# EAGLE design SSPS Front Panel Test (EAGLE 7.4.0)
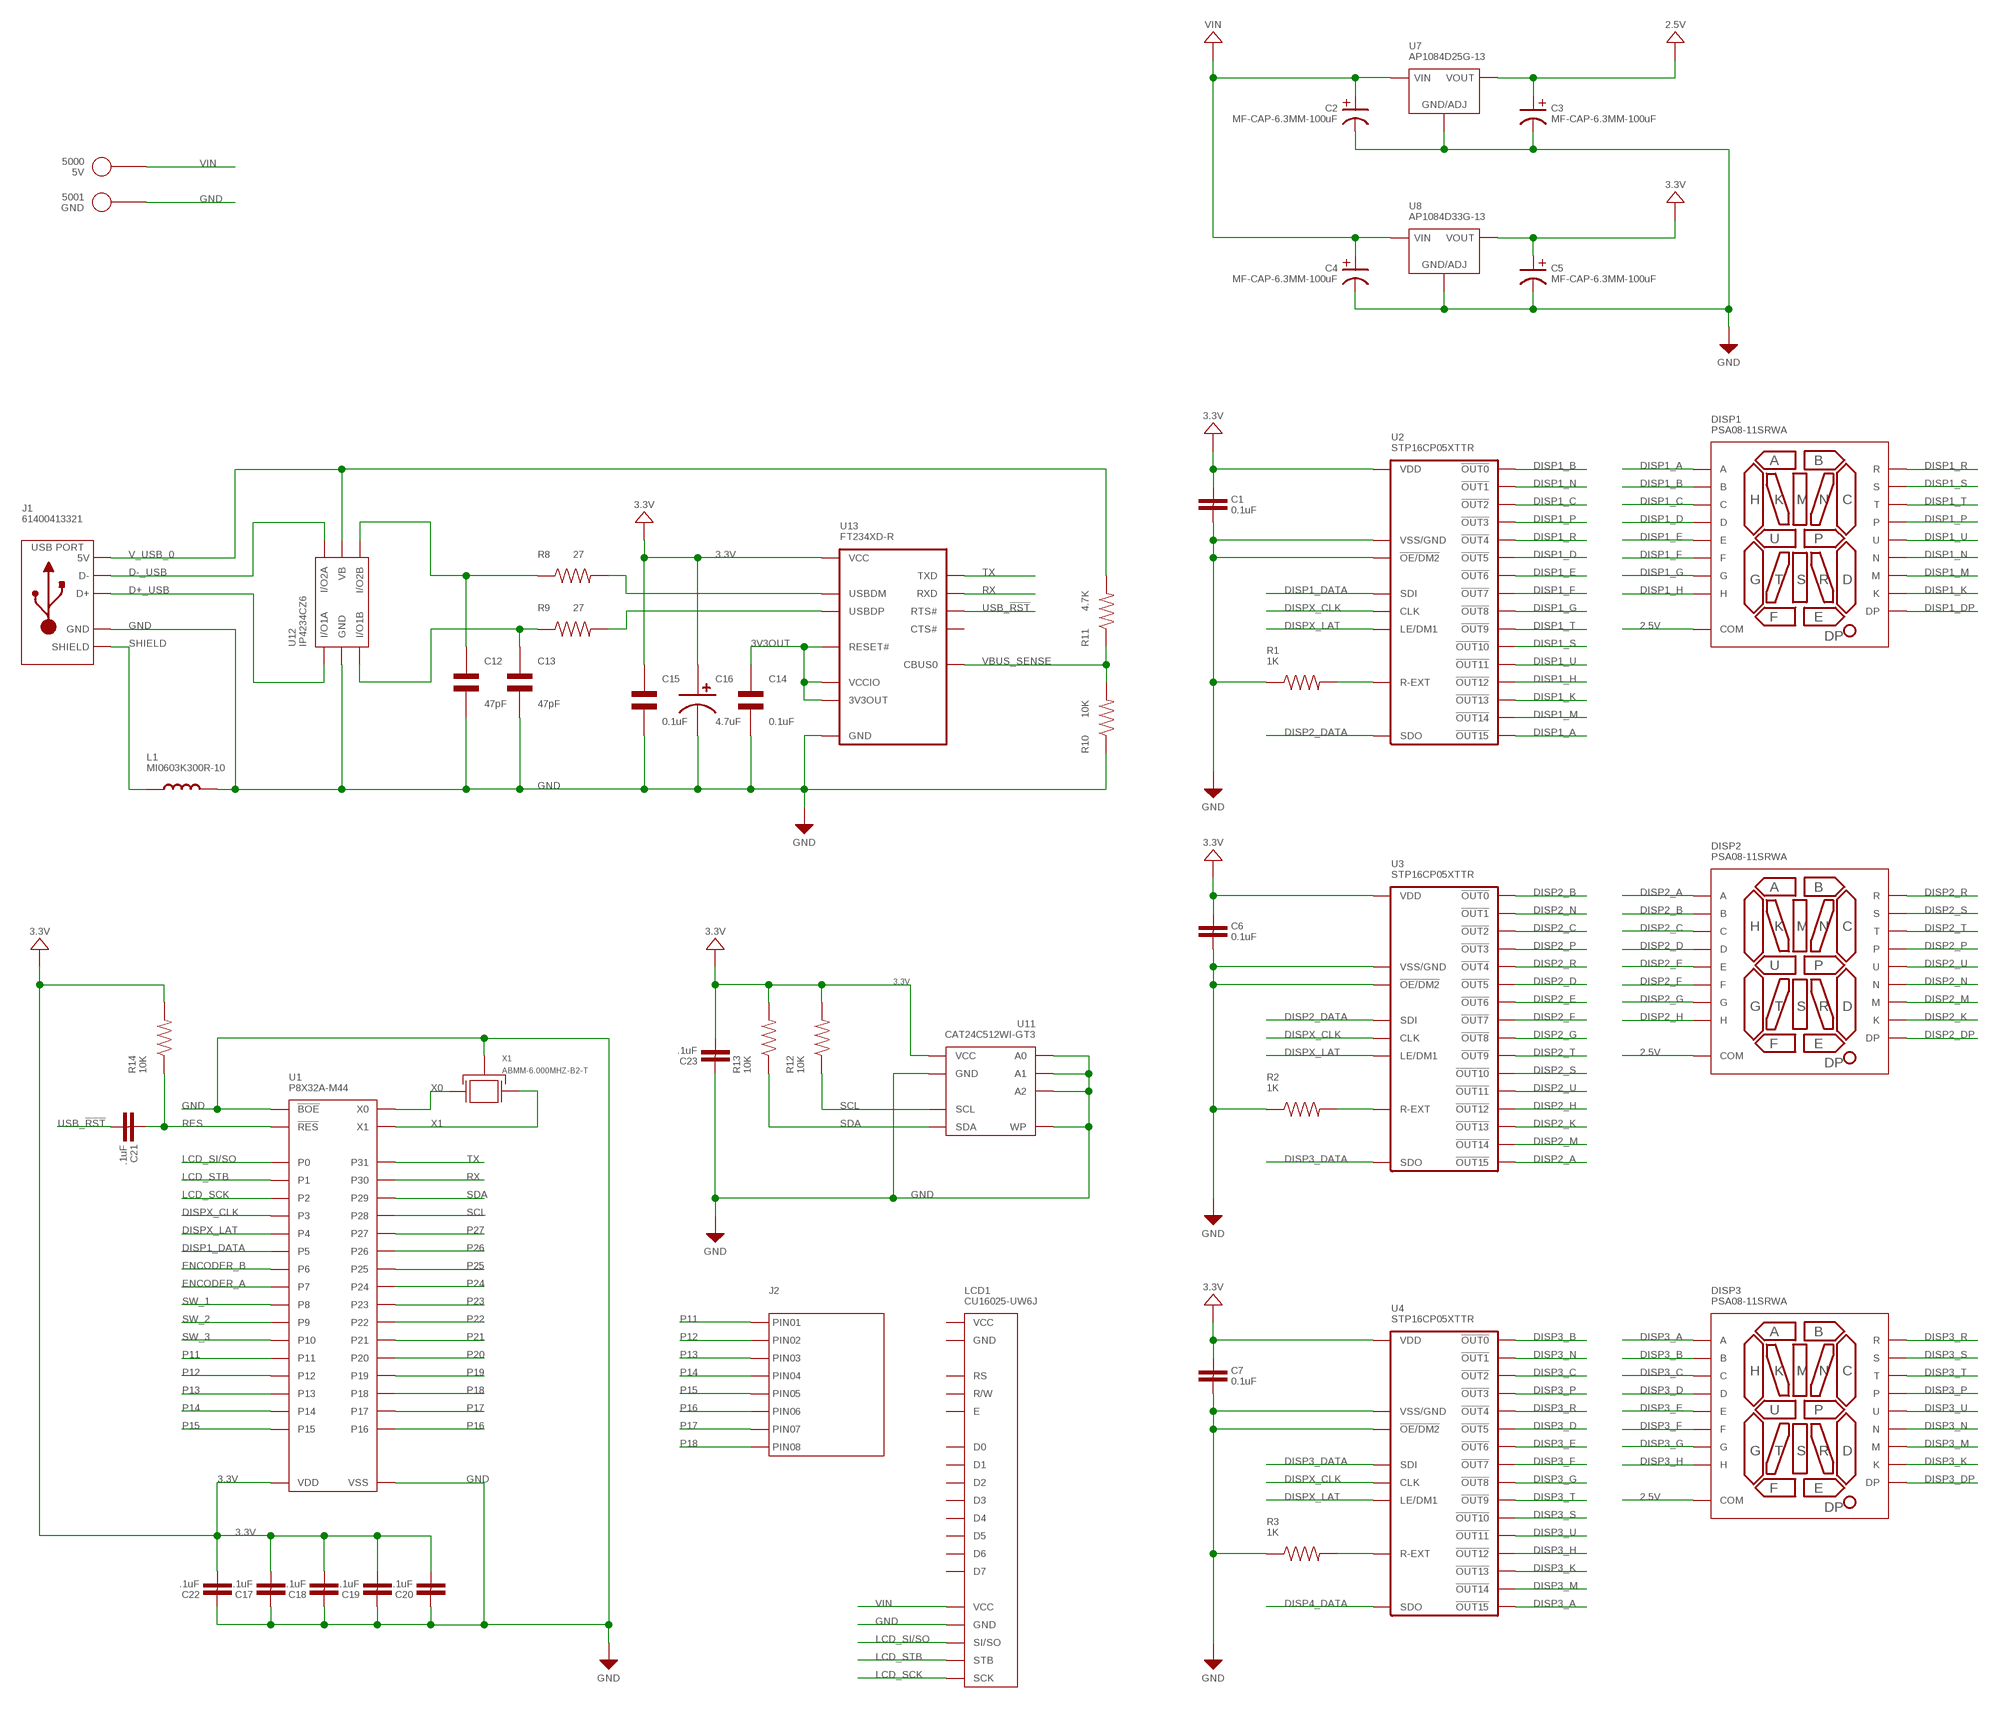
[diagram p0: schematic, sheet 1, part 1 of 3]
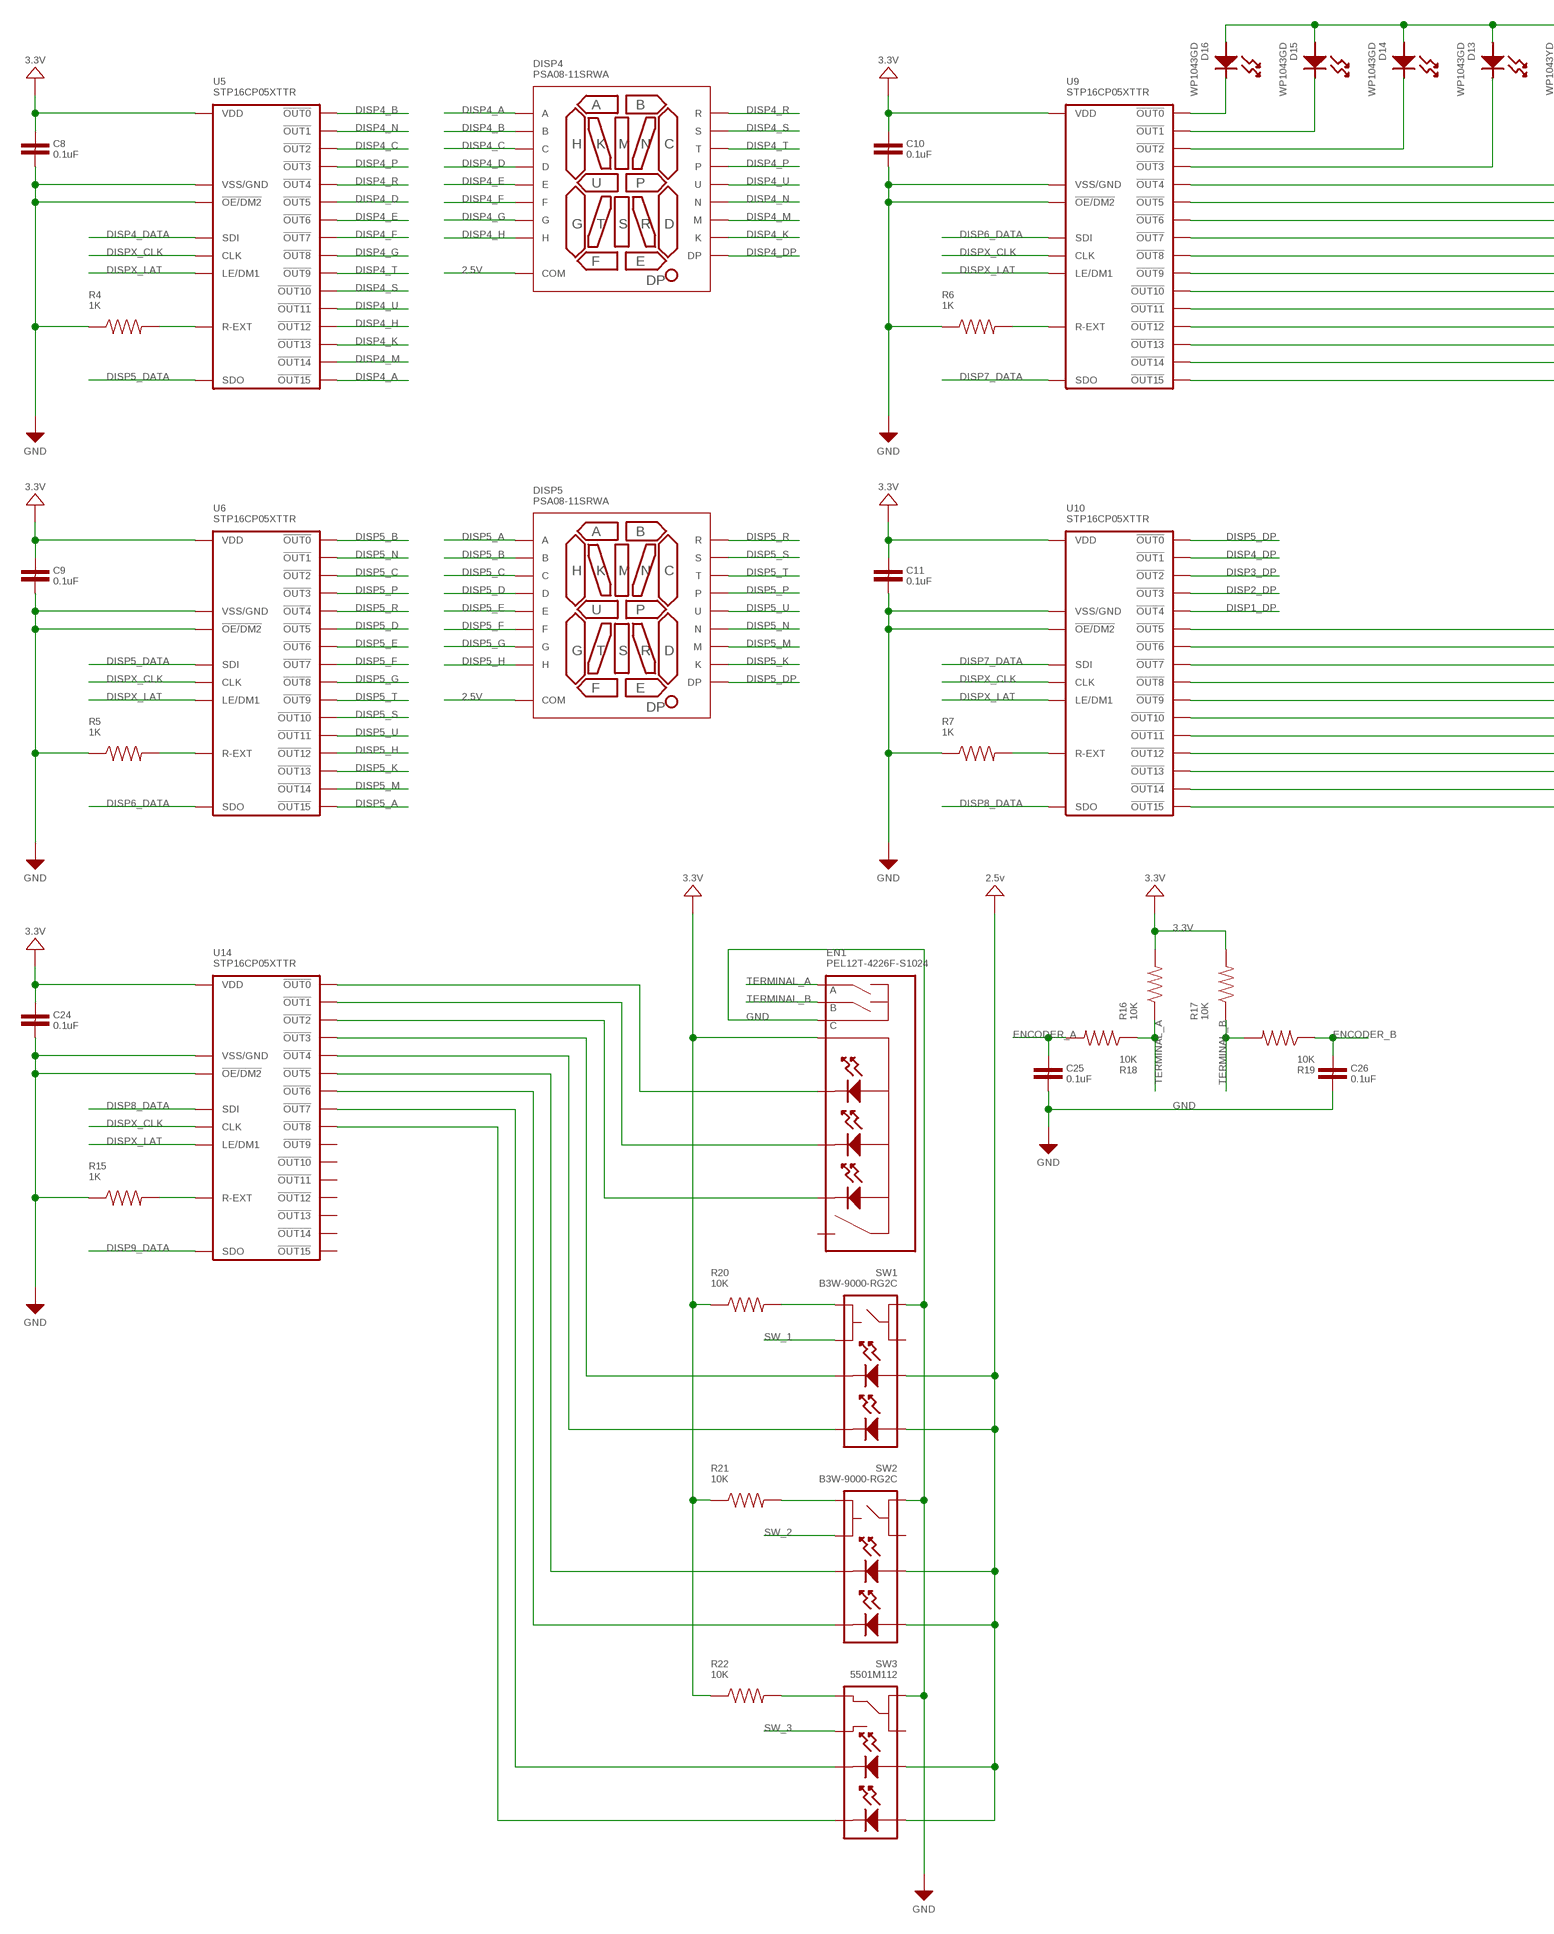
[diagram p1: schematic, sheet 1, part 2 of 3]
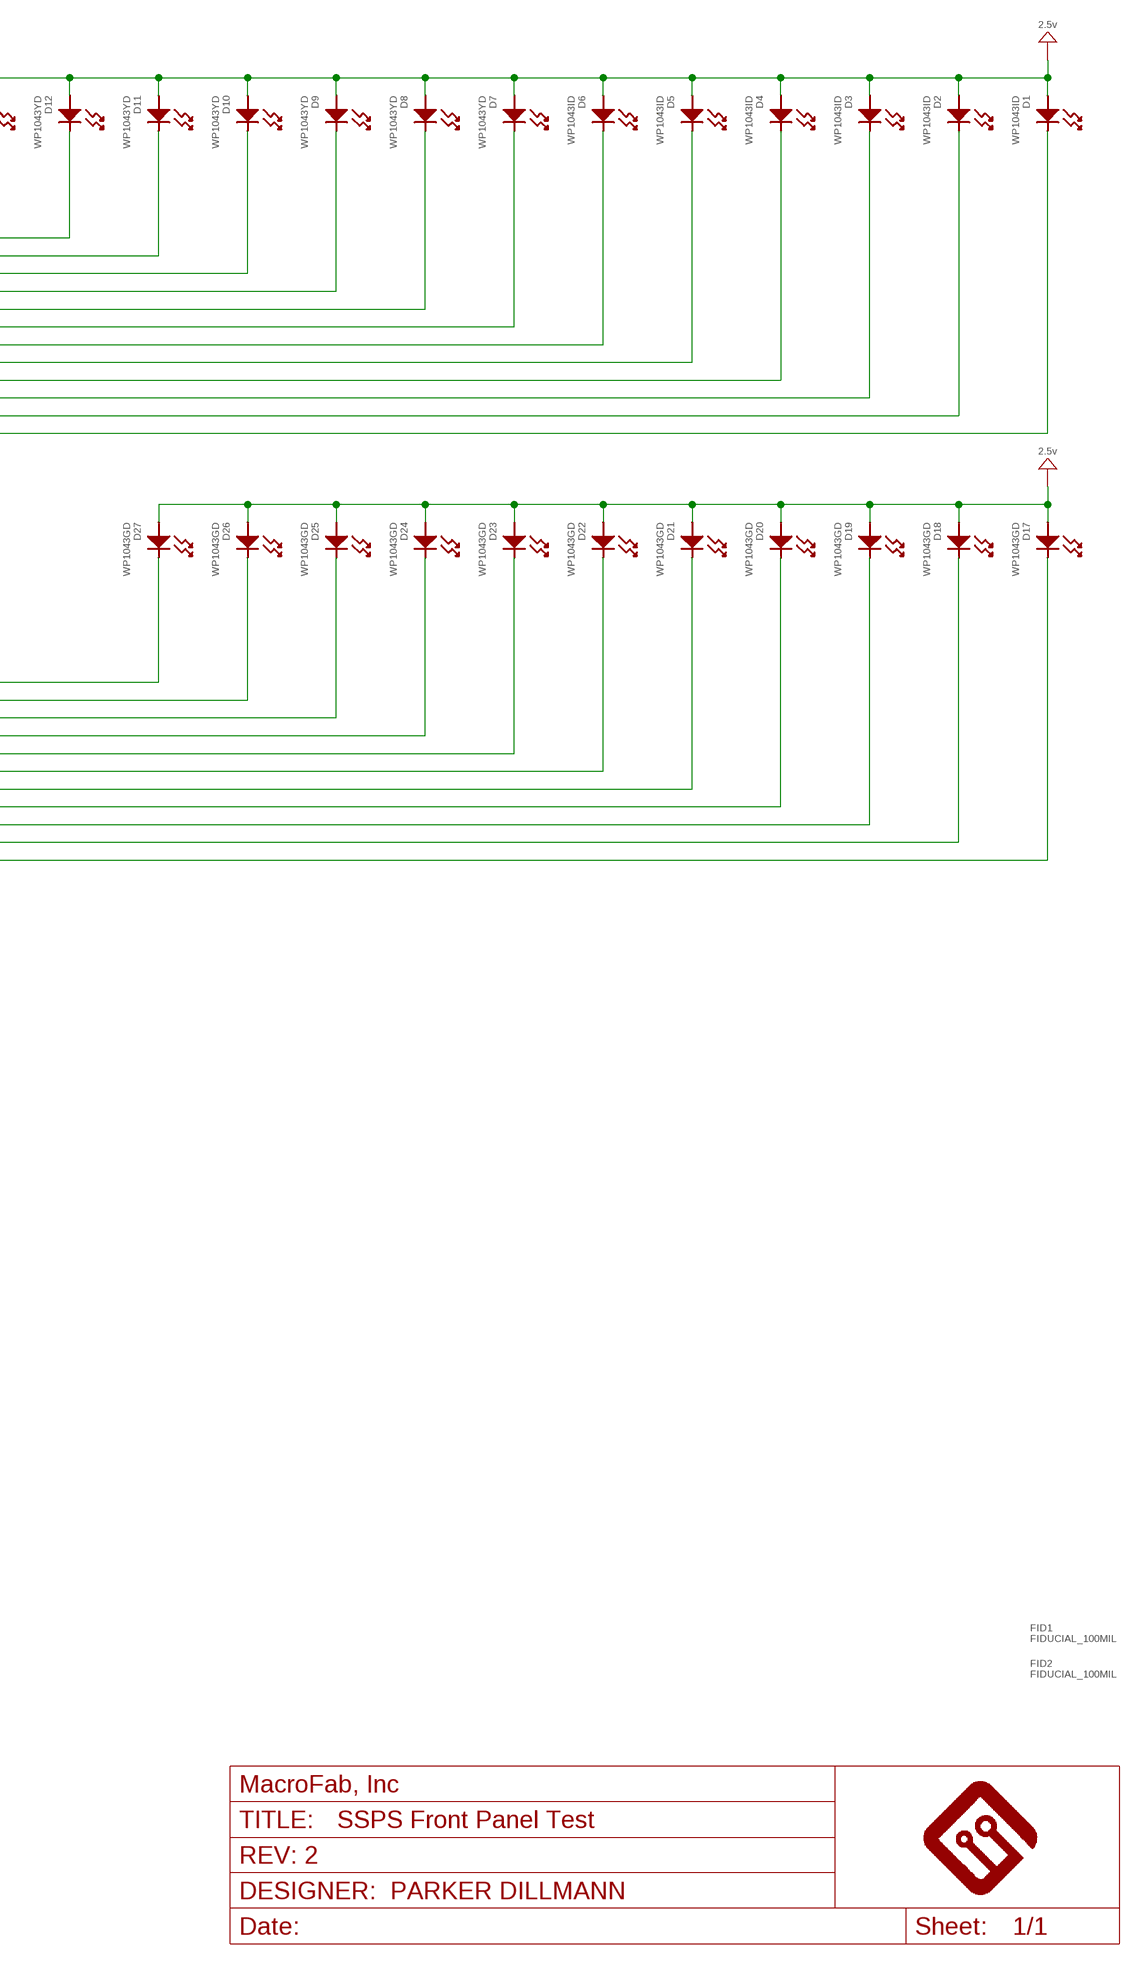
[diagram p2: schematic, sheet 1, part 3 of 3]

## Parts
5V  5000  TEST_POINT_SINGLE_KEYSTONE_5115-5119  [KEYSTONE_5115-5119]
C1  0.1uF  CAPACITOR_NON_POLAR_0603  [0603]
C2  MF-CAP-6.3MM-100uF  CAPACITOR_POLARIZED_6.3MM_SMD  [6.3MM_CAP_SMD]
C3  MF-CAP-6.3MM-100uF  CAPACITOR_POLARIZED_6.3MM_SMD  [6.3MM_CAP_SMD]
C4  MF-CAP-6.3MM-100uF  CAPACITOR_POLARIZED_6.3MM_SMD  [6.3MM_CAP_SMD]
C5  MF-CAP-6.3MM-100uF  CAPACITOR_POLARIZED_6.3MM_SMD  [6.3MM_CAP_SMD]
C6  0.1uF  CAPACITOR_NON_POLAR_0603  [0603]
C7  0.1uF  CAPACITOR_NON_POLAR_0603  [0603]
C8  0.1uF  CAPACITOR_NON_POLAR_0603  [0603]
C9  0.1uF  CAPACITOR_NON_POLAR_0603  [0603]
C10  0.1uF  CAPACITOR_NON_POLAR_0603  [0603]
C11  0.1uF  CAPACITOR_NON_POLAR_0603  [0603]
C12  47pF  CAPACITOR_NP_0603  [C0603]
C13  47pF  CAPACITOR_NP_0603  [C0603]
C14  0.1uF  CAPACITOR_NP_0603  [C0603]
C15  0.1uF  CAPACITOR_NP_0603  [C0603]
C16  4.7uF  CAPACITOR_P_4MM  [CP4MM]
C17  .1uF  CAPACITOR_NON_POLAR_0603  [0603]
C18  .1uF  CAPACITOR_NON_POLAR_0603  [0603]
C19  .1uF  CAPACITOR_NON_POLAR_0603  [0603]
C20  .1uF  CAPACITOR_NON_POLAR_0603  [0603]
C21  .1uF  CAPACITOR_NON_POLAR_0603  [0603]
C22  .1uF  CAPACITOR_NON_POLAR_0603  [0603]
C23  .1uF  CAPACITOR_NON_POLAR_0603  [0603]
C24  0.1uF  CAPACITOR_NON_POLAR_0603  [0603]
C25  0.1uF  CAPACITOR_NON_POLAR_0603  [0603]
C26  0.1uF  CAPACITOR_NON_POLAR_0603  [0603]
D1  WP1043ID  LED_SINGLE_WP1043  [WP1043]
D2  WP1043ID  LED_SINGLE_WP1043  [WP1043]
D3  WP1043ID  LED_SINGLE_WP1043  [WP1043]
D4  WP1043ID  LED_SINGLE_WP1043  [WP1043]
D5  WP1043ID  LED_SINGLE_WP1043  [WP1043]
D6  WP1043ID  LED_SINGLE_WP1043  [WP1043]
D7  WP1043YD  LED_SINGLE_WP1043  [WP1043]
D8  WP1043YD  LED_SINGLE_WP1043  [WP1043]
D9  WP1043YD  LED_SINGLE_WP1043  [WP1043]
D10  WP1043YD  LED_SINGLE_WP1043  [WP1043]
D11  WP1043YD  LED_SINGLE_WP1043  [WP1043]
D12  WP1043YD  LED_SINGLE_WP1043  [WP1043]
D13  WP1043GD  LED_SINGLE_WP1043  [WP1043]
D14  WP1043GD  LED_SINGLE_WP1043  [WP1043]
D15  WP1043GD  LED_SINGLE_WP1043  [WP1043]
D16  WP1043GD  LED_SINGLE_WP1043  [WP1043]
D17  WP1043GD  LED_SINGLE_WP1043  [WP1043]
D18  WP1043GD  LED_SINGLE_WP1043  [WP1043]
D19  WP1043GD  LED_SINGLE_WP1043  [WP1043]
D20  WP1043GD  LED_SINGLE_WP1043  [WP1043]
D21  WP1043GD  LED_SINGLE_WP1043  [WP1043]
D22  WP1043GD  LED_SINGLE_WP1043  [WP1043]
D23  WP1043GD  LED_SINGLE_WP1043  [WP1043]
D24  WP1043GD  LED_SINGLE_WP1043  [WP1043]
D25  WP1043GD  LED_SINGLE_WP1043  [WP1043]
D26  WP1043GD  LED_SINGLE_WP1043  [WP1043]
D27  WP1043GD  LED_SINGLE_WP1043  [WP1043]
DISP1  PSA08-11SRWA  [PSA08-11SRWA]
DISP2  PSA08-11SRWA  [PSA08-11SRWA]
DISP3  PSA08-11SRWA  [PSA08-11SRWA]
DISP4  PSA08-11SRWA  [PSA08-11SRWA]
DISP5  PSA08-11SRWA  [PSA08-11SRWA]
EN1  PEL12T-4226F-S1024  PEL12T  [PEL12T]
FID1  FIDUCIAL_100MIL  [FIDUCIAL_100MIL]
FID2  FIDUCIAL_100MIL  [FIDUCIAL_100MIL]
FRAME1  MF_FRAMEDEFAULT  [MF_FRAME_DEFAULT]
GND  5001  TEST_POINT_SINGLE_KEYSTONE_5115-5119  [KEYSTONE_5115-5119]
J1  61400413321  USB_4PIN_61400413321  [61400413321]
J2  CON_01X08_2.54MM_PIN_HEADER  [2.54MM_01X08_PIN_HEADER]
L1  MI0603K300R-10  INDUCTOR_0603  [L0603]
LCD1  CU16025-UW6J  CU16025-UWJ6  [CU16025-UW6J]
R1  1K  RESISTOR_0603  [0603]
R2  1K  RESISTOR_0603  [0603]
R3  1K  RESISTOR_0603  [0603]
R4  1K  RESISTOR_0603  [0603]
R5  1K  RESISTOR_0603  [0603]
R6  1K  RESISTOR_0603  [0603]
R7  1K  RESISTOR_0603  [0603]
R8  27  RESISTOR_0603  [R0603]
R9  27  RESISTOR_0603  [R0603]
R10  10K  RESISTOR_0603  [R0603]
R11  4.7K  RESISTOR_0603  [R0603]
R12  10K  RESISTOR_0603  [0603]
R13  10K  RESISTOR_0603  [0603]
R14  10K  RESISTOR_0603  [0603]
R15  1K  RESISTOR_0603  [0603]
R16  10K  RESISTOR_0603  [0603]
R17  10K  RESISTOR_0603  [0603]
R18  10K  RESISTOR_0603  [0603]
R19  10K  RESISTOR_0603  [0603]
R20  10K  RESISTOR_0603  [0603]
R21  10K  RESISTOR_0603  [0603]
R22  10K  RESISTOR_0603  [0603]
SW1  B3W-9000-RG2C  B3W-9000  [B3W-9000]
SW2  B3W-9000-RG2C  B3W-9000  [B3W-9000]
SW3  5501M112  5501  [5501]
U1  P8X32A-M44  [P8X32A_QFN-44]
U2  STP16CP05XTTR  [STP16CP05XTTR_TTSOP-24]
U3  STP16CP05XTTR  [STP16CP05XTTR_TTSOP-24]
U4  STP16CP05XTTR  [STP16CP05XTTR_TTSOP-24]
U5  STP16CP05XTTR  [STP16CP05XTTR_TTSOP-24]
U6  STP16CP05XTTR  [STP16CP05XTTR_TTSOP-24]
U7  AP1084D25G-13  LINEAR_VOTLAGE_REGULATORS_AP1084  [AP1084_TO-252-3L]
U8  AP1084D33G-13  LINEAR_VOTLAGE_REGULATORS_AP1084  [AP1084_TO-252-3L]
U9  STP16CP05XTTR  [STP16CP05XTTR_TTSOP-24]
U10  STP16CP05XTTR  [STP16CP05XTTR_TTSOP-24]
U11  CAT24C512WI-GT3  EEPROM_I2CSOIC-8_W  [SOIC-8_W]
U12  IP4234CZ6  [IP4234CZ6_SOT-457-6]
U13  FT234XD-R  FT234XD  [FT234X_DFN-12]
U14  STP16CP05XTTR  [STP16CP05XTTR_TTSOP-24]
X1  ABMM-6.000MHZ-B2-T  XTL_7MMX5MM  [7MMX5MM]

## Nets
2.5V: C3.POS D1.A(ANODE) D2.A(ANODE) D3.A(ANODE) D4.A(ANODE) D5.A(ANODE) D6.A(ANODE) D7.A(ANODE) D8.A(ANODE) D9.A(ANODE) D10.A(ANODE) D11.A(ANODE) D12.A(ANODE) D13.A(ANODE) D14.A(ANODE) D15.A(ANODE) D16.A(ANODE) D17.A(ANODE) D18.A(ANODE) D19.A(ANODE) D20.A(ANODE) D21.A(ANODE) D22.A(ANODE) D23.A(ANODE) D24.A(ANODE) D25.A(ANODE) D26.A(ANODE) D27.A(ANODE) DISP1.P$11(COM) DISP2.P$11(COM) DISP3.P$11(COM) DISP4.P$11(COM) DISP5.P$11(COM) SW1.ANODE_1 SW1.ANODE_2 SW2.ANODE_1 SW2.ANODE_2 SW3.ANODE_1 SW3.ANODE_2 U7.3(OUT) ; supply symbol labelled 2.5v
3.3V: C1.1 C5.POS C6.1 C7.1 C8.1 C9.1 C10.1 C11.1 C15.P$1 C16.P$1 C17.2 C18.2 C19.2 C20.2 C22.2 C23.2 C24.1 EN1.5 R12.2 R13.2 R14.2 R16.2 R17.2 R20.1 R21.1 R22.1 U1.8(VDD) U1.18(VDD) U1.30(VDD) U1.40(VDD) U2.P$24(VDD) U3.P$24(VDD) U4.P$24(VDD) U5.P$24(VDD) U6.P$24(VDD) U8.3(OUT) U9.P$24(VDD) U10.P$24(VDD) U11.8(VCC) U13.4(VCC) U14.P$24(VDD)
3V3OUT: C14.P$1 U13.2(RESET#) U13.3(3V3OUT) U13.9(VCCIO)
D+_USB: J1.3(D+) U12.1(I/O1A)
D-_USB: J1.2(D-) U12.6(I/O2A)
DISP1_A: DISP1.P$1(A) U2.P$20(!OUT15)
DISP1_B: DISP1.P$18(B) U2.P$5(!OUT0)
DISP1_C: DISP1.P$16(C) U2.P$7(!OUT2)
DISP1_D: DISP1.P$13(D) U2.P$10(!OUT5)
DISP1_DATA: U1.2(P5) U2.P$2(SDI)
DISP1_DP: DISP1.P$12(DP) U10.P$9(!OUT4)
DISP1_E: DISP1.P$10(E) U2.P$11(!OUT6)
DISP1_F: DISP1.P$9(F) U2.P$12(!OUT7)
DISP1_G: DISP1.P$8(G) U2.P$13(!OUT8)
DISP1_H: DISP1.P$4(H) U2.P$17(!OUT12)
DISP1_K: DISP1.P$3(K) U2.P$18(!OUT13)
DISP1_M: DISP1.P$2(M) U2.P$19(!OUT14)
DISP1_N: DISP1.P$17(N) U2.P$6(!OUT1)
DISP1_P: DISP1.P$15(P) U2.P$8(!OUT3)
DISP1_R: DISP1.P$14(R) U2.P$9(!OUT4)
DISP1_S: DISP1.P$6(S) U2.P$15(!OUT10)
DISP1_T: DISP1.P$7(T) U2.P$14(!OUT9)
DISP1_U: DISP1.P$5(U) U2.P$16(!OUT11)
DISP2_A: DISP2.P$1(A) U3.P$20(!OUT15)
DISP2_B: DISP2.P$18(B) U3.P$5(!OUT0)
DISP2_C: DISP2.P$16(C) U3.P$7(!OUT2)
DISP2_D: DISP2.P$13(D) U3.P$10(!OUT5)
DISP2_DATA: U2.P$22(SDO) U3.P$2(SDI)
DISP2_DP: DISP2.P$12(DP) U10.P$8(!OUT3)
DISP2_E: DISP2.P$10(E) U3.P$11(!OUT6)
DISP2_F: DISP2.P$9(F) U3.P$12(!OUT7)
DISP2_G: DISP2.P$8(G) U3.P$13(!OUT8)
DISP2_H: DISP2.P$4(H) U3.P$17(!OUT12)
DISP2_K: DISP2.P$3(K) U3.P$18(!OUT13)
DISP2_M: DISP2.P$2(M) U3.P$19(!OUT14)
DISP2_N: DISP2.P$17(N) U3.P$6(!OUT1)
DISP2_P: DISP2.P$15(P) U3.P$8(!OUT3)
DISP2_R: DISP2.P$14(R) U3.P$9(!OUT4)
DISP2_S: DISP2.P$6(S) U3.P$15(!OUT10)
DISP2_T: DISP2.P$7(T) U3.P$14(!OUT9)
DISP2_U: DISP2.P$5(U) U3.P$16(!OUT11)
DISP3_A: DISP3.P$1(A) U4.P$20(!OUT15)
DISP3_B: DISP3.P$18(B) U4.P$5(!OUT0)
DISP3_C: DISP3.P$16(C) U4.P$7(!OUT2)
DISP3_D: DISP3.P$13(D) U4.P$10(!OUT5)
DISP3_DATA: U3.P$22(SDO) U4.P$2(SDI)
DISP3_DP: DISP3.P$12(DP) U10.P$7(!OUT2)
DISP3_E: DISP3.P$10(E) U4.P$11(!OUT6)
DISP3_F: DISP3.P$9(F) U4.P$12(!OUT7)
DISP3_G: DISP3.P$8(G) U4.P$13(!OUT8)
DISP3_H: DISP3.P$4(H) U4.P$17(!OUT12)
DISP3_K: DISP3.P$3(K) U4.P$18(!OUT13)
DISP3_M: DISP3.P$2(M) U4.P$19(!OUT14)
DISP3_N: DISP3.P$17(N) U4.P$6(!OUT1)
DISP3_P: DISP3.P$15(P) U4.P$8(!OUT3)
DISP3_R: DISP3.P$14(R) U4.P$9(!OUT4)
DISP3_S: DISP3.P$6(S) U4.P$15(!OUT10)
DISP3_T: DISP3.P$7(T) U4.P$14(!OUT9)
DISP3_U: DISP3.P$5(U) U4.P$16(!OUT11)
DISP4_A: DISP4.P$1(A) U5.P$20(!OUT15)
DISP4_B: DISP4.P$18(B) U5.P$5(!OUT0)
DISP4_C: DISP4.P$16(C) U5.P$7(!OUT2)
DISP4_D: DISP4.P$13(D) U5.P$10(!OUT5)
DISP4_DATA: U4.P$22(SDO) U5.P$2(SDI)
DISP4_DP: DISP4.P$12(DP) U10.P$6(!OUT1)
DISP4_E: DISP4.P$10(E) U5.P$11(!OUT6)
DISP4_F: DISP4.P$9(F) U5.P$12(!OUT7)
DISP4_G: DISP4.P$8(G) U5.P$13(!OUT8)
DISP4_H: DISP4.P$4(H) U5.P$17(!OUT12)
DISP4_K: DISP4.P$3(K) U5.P$18(!OUT13)
DISP4_M: DISP4.P$2(M) U5.P$19(!OUT14)
DISP4_N: DISP4.P$17(N) U5.P$6(!OUT1)
DISP4_P: DISP4.P$15(P) U5.P$8(!OUT3)
DISP4_R: DISP4.P$14(R) U5.P$9(!OUT4)
DISP4_S: DISP4.P$6(S) U5.P$15(!OUT10)
DISP4_T: DISP4.P$7(T) U5.P$14(!OUT9)
DISP4_U: DISP4.P$5(U) U5.P$16(!OUT11)
DISP5_A: DISP5.P$1(A) U6.P$20(!OUT15)
DISP5_B: DISP5.P$18(B) U6.P$5(!OUT0)
DISP5_C: DISP5.P$16(C) U6.P$7(!OUT2)
DISP5_D: DISP5.P$13(D) U6.P$10(!OUT5)
DISP5_DATA: U5.P$22(SDO) U6.P$2(SDI)
DISP5_DP: DISP5.P$12(DP) U10.P$5(!OUT0)
DISP5_E: DISP5.P$10(E) U6.P$11(!OUT6)
DISP5_F: DISP5.P$9(F) U6.P$12(!OUT7)
DISP5_G: DISP5.P$8(G) U6.P$13(!OUT8)
DISP5_H: DISP5.P$4(H) U6.P$17(!OUT12)
DISP5_K: DISP5.P$3(K) U6.P$18(!OUT13)
DISP5_M: DISP5.P$2(M) U6.P$19(!OUT14)
DISP5_N: DISP5.P$17(N) U6.P$6(!OUT1)
DISP5_P: DISP5.P$15(P) U6.P$8(!OUT3)
DISP5_R: DISP5.P$14(R) U6.P$9(!OUT4)
DISP5_S: DISP5.P$6(S) U6.P$15(!OUT10)
DISP5_T: DISP5.P$7(T) U6.P$14(!OUT9)
DISP5_U: DISP5.P$5(U) U6.P$16(!OUT11)
DISP6_DATA: U6.P$22(SDO) U9.P$2(SDI)
DISP7_DATA: U9.P$22(SDO) U10.P$2(SDI)
DISP8_DATA: U10.P$22(SDO) U14.P$2(SDI)
DISP9_DATA: U14.P$22(SDO)
DISPX_CLK: U1.44(P3) U2.P$3(CLK) U3.P$3(CLK) U4.P$3(CLK) U5.P$3(CLK) U6.P$3(CLK) U9.P$3(CLK) U10.P$3(CLK) U14.P$3(CLK)
DISPX_LAT: U1.1(P4) U2.P$4(LE/DM1) U3.P$4(LE/DM1) U4.P$4(LE/DM1) U5.P$4(LE/DM1) U6.P$4(LE/DM1) U9.P$4(LE/DM1) U10.P$4(LE/DM1) U14.P$4(LE/DM1)
ENCODER_A: C25.1 R18.2 U1.4(P7)
ENCODER_B: C26.1 R19.1 U1.3(P6)
GND: C1.2 C2.NEG C3.NEG C4.NEG C5.NEG C6.2 C7.2 C8.2 C9.2 C10.2 C11.2 C12.P$2 C13.P$2 C14.P$2 C15.P$2 C16.P$2 C17.1 C18.1 C19.1 C20.1 C22.1 C23.1 C24.2 C25.2 C26.2 EN1.C GND.P$1 J1.4(GND) L1.P$2 LCD1.P$18(GND2) R1.1 R2.1 R3.1 R4.1 R5.1 R6.1 R7.1 R10.P$1 R15.1 SW1.1 SW2.1 SW3.1A U1.5(VSS) U1.6(!BOE) U1.17(VSS) U1.27(VSS) U1.39(VSS) U2.P$1(VSS/GND) U2.P$21(!OE/DM2) U2.PAD(VSS/GND) U3.P$1(VSS/GND) U3.P$21(!OE/DM2) U3.PAD(VSS/GND) U4.P$1(VSS/GND) U4.P$21(!OE/DM2) U4.PAD(VSS/GND) U5.P$1(VSS/GND) U5.P$21(!OE/DM2) U5.PAD(VSS/GND) U6.P$1(VSS/GND) U6.P$21(!OE/DM2) U6.PAD(VSS/GND) U7.1(GND) U8.1(GND) U9.P$1(VSS/GND) U9.P$21(!OE/DM2) U9.PAD(VSS/GND) U10.P$1(VSS/GND) U10.P$21(!OE/DM2) U10.PAD(VSS/GND) U11.1(A0) U11.2(A1) U11.3(A2) U11.4(GND) U11.7(WP) U12.2(GND) U13.5(GND) U13.P$1(GND) U14.P$1(VSS/GND) U14.P$21(!OE/DM2) U14.PAD(VSS/GND) X1.P$2(GND) X1.P$4(GND)
LCD_SCK: LCD1.P$16(SCK) U1.43(P2)
LCD_SI/SO: LCD1.P$19(SI/SO) U1.41(P0)
LCD_STB: LCD1.P$17(STB) U1.42(P1)
N$1: R1.2 U2.P$23(R-EXT)
N$2: R2.2 U3.P$23(R-EXT)
N$3: R3.2 U4.P$23(R-EXT)
N$4: R4.2 U5.P$23(R-EXT)
N$5: R5.2 U6.P$23(R-EXT)
N$6: R6.2 U9.P$23(R-EXT)
N$7: D16.C(CATHODE) U9.P$5(!OUT0)
N$8: D15.C(CATHODE) U9.P$6(!OUT1)
N$9: D14.C(CATHODE) U9.P$7(!OUT2)
N$10: D13.C(CATHODE) U9.P$8(!OUT3)
N$11: D12.C(CATHODE) U9.P$9(!OUT4)
N$12: D17.C(CATHODE) U10.P$20(!OUT15)
N$13: D10.C(CATHODE) U9.P$11(!OUT6)
N$14: D9.C(CATHODE) U9.P$12(!OUT7)
N$15: D8.C(CATHODE) U9.P$13(!OUT8)
N$16: D7.C(CATHODE) U9.P$14(!OUT9)
N$17: D6.C(CATHODE) U9.P$15(!OUT10)
N$18: D5.C(CATHODE) U9.P$16(!OUT11)
N$19: D4.C(CATHODE) U9.P$17(!OUT12)
N$20: D3.C(CATHODE) U9.P$18(!OUT13)
N$21: D2.C(CATHODE) U9.P$19(!OUT14)
N$22: D1.C(CATHODE) U9.P$20(!OUT15)
N$23: R7.2 U10.P$23(R-EXT)
N$24: D18.C(CATHODE) U10.P$19(!OUT14)
N$25: D19.C(CATHODE) U10.P$18(!OUT13)
N$26: D20.C(CATHODE) U10.P$17(!OUT12)
N$27: D21.C(CATHODE) U10.P$16(!OUT11)
N$28: D22.C(CATHODE) U10.P$15(!OUT10)
N$29: D23.C(CATHODE) U10.P$14(!OUT9)
N$30: D24.C(CATHODE) U10.P$13(!OUT8)
N$31: D25.C(CATHODE) U10.P$12(!OUT7)
N$32: D26.C(CATHODE) U10.P$11(!OUT6)
N$33: D27.C(CATHODE) U10.P$10(!OUT5)
N$34: R8.P$2 U13.1(USBDM)
N$35: D11.C(CATHODE) U9.P$10(!OUT5)
N$36: R9.P$2 U13.12(USBDP)
N$37: C12.P$1 R8.P$1 U12.4(I/O2B)
N$38: C13.P$1 R9.P$1 U12.3(I/O1B)
N$39: R15.2 U14.P$23(R-EXT)
N$40: EN1.1 U14.P$5(!OUT0)
N$41: EN1.2 U14.P$6(!OUT1)
N$42: EN1.4 U14.P$7(!OUT2)
N$43: SW1.CATHODE_1 U14.P$8(!OUT3)
N$44: SW1.CATHODE_2 U14.P$9(!OUT4)
N$45: SW2.CATHODE_1 U14.P$10(!OUT5)
N$46: SW2.CATHODE_2 U14.P$11(!OUT6)
N$47: SW3.CATHODE_1 U14.P$12(!OUT7)
N$48: SW3.CATHODE_2 U14.P$13(!OUT8)
N$49: R20.2 SW1.3
N$50: R21.2 SW2.3
N$54: R22.2 SW3.2
P11: J2.1 U1.12(P11)
P12: J2.2 U1.13(P12)
P13: J2.3 U1.14(P13)
P14: J2.4 U1.15(P14)
P15: J2.5 U1.16(P15)
P16: J2.6 U1.19(P16)
P17: J2.7 U1.20(P17)
P18: J2.8 U1.21(P18)
P19: U1.22(P19)
P20: U1.23(P20)
P21: U1.24(P21)
P22: U1.25(P22)
P23: U1.26(P23)
P24: U1.31(P24)
P25: U1.32(P25)
P26: U1.33(P26)
P27: U1.34(P27)
RES: C21.1 R14.1 U1.7(!RES)
RX: U1.37(P30) U13.10(RXD)
SCL: R12.1 U1.35(P28) U11.6(SCL)
SDA: R13.1 U1.36(P29) U11.5(SDA)
SHIELD: J1.S1(SLD) J1.S2(SLD) L1.P$1
SW_1: SW1.4 U1.9(P8)
SW_2: SW2.4 U1.10(P9)
SW_3: SW3.3 U1.11(P10)
TERMINAL_A: EN1.A R16.1 R18.1
TERMINAL_B: EN1.B R17.1 R19.2
TX: U1.38(P31) U13.7(TXD)
USB_!RST: C21.2 U13.8(RTS#)
V_USB_0: J1.1(5V) R11.P$2 U12.5(VB)
VBUS_SENSE: R10.P$2 R11.P$1 U13.6(CBUS0)
VIN: 5V.P$1 C2.POS C4.POS LCD1.P$20(VCC2) U7.2(IN) U8.2(IN)
X0: U1.29(X0) X1.P$3(X1)
X1: U1.28(X1) X1.P$1(X0)
Unconnected: EN1.3 LCD1.P$1(GND1) LCD1.P$2(VCC1) LCD1.P$4(RS) LCD1.P$5(R/W) LCD1.P$6(E) LCD1.P$7(D0) LCD1.P$8(D1) LCD1.P$9(D2) LCD1.P$10(D3) LCD1.P$11(D4) LCD1.P$12(D5) LCD1.P$13(D6) LCD1.P$14(D7) SW1.2 SW2.2 SW3.1B U13.11(CTS#) U14.P$14(!OUT9) U14.P$15(!OUT10) U14.P$16(!OUT11) U14.P$17(!OUT12) U14.P$18(!OUT13) U14.P$19(!OUT14) U14.P$20(!OUT15)

## Library data of the parts
5V GND = PP_Connectors:TEST_POINT_SINGLE
C1 C6-C11 C17-C26 = PP_Passives:CAPACITOR_NON_POLAR: Capacitor Non Polarized
C2-C5 = PP_Passives:CAPACITOR_POLARIZED: Polarized capacitors
C12-C15 = MF_Passives:CAPACITOR_NP: Library: MF_Passives Description: Device for Non-Polarized Capacitors. Manufacture part number (MFG#), Voltage, Temperature Coefficient, and Tolerance can be added via Attributes.; MFG#: N/A; TEMP_COF: N/A; TOLERANCE: N/A; VOLTAGE: N/A
C16 = MF_Passives:CAPACITOR_P: Library: MF_Passives Description: Device for Polarized Capacitors. Manufacture part number (MFG#), Voltage Rating, and Tolerance can be added via Attributes.; MFG#: N/A; TOLERANCE: N/A; VOLTAGE: N/A
D1-D27 = PP_LED:LED_SINGLE
DISP1-DISP5 = PP_LED:PSA08-11SRWA
EN1 = PP_Electromechanical:PEL12T
FID1 FID2 = MF_Aesthetics:FIDUCIAL: Library: MF_Aesthetics Description: Fiducial marking for PCB alignment inside PNP and other machines.
FRAME1 = MF_Aesthetics:MF_FRAME: Library: MF_Aesthetics Description: Frame for adding Meta Data to the PCB and Schematic.; DNAME: PARKER DILLMANN; REVNUM: REV: 2
J1 = PP_Connectors:USB_4PIN
J2 = PP_Connectors:CON_01X08
L1 = MF_Passives:INDUCTOR: Library: MF_Passives Description: Device for Inductors. Manufacture part number (MFG#) can be added via Attributes.; MFG#: N/A
LCD1 = PP_Displays:CU16025-UWJ6
R1-R7 R12-R22 = PP_Passives:RESISTOR: Resistors
R8-R11 = MF_Passives:RESISTOR: Library: MF_Passives Description: Device for Resistors. Manufacture part number (MFG#), Voltage, Tolerance, and Wattage Rating can be added via Attributes.; MFG#: N/A; TOLERANCE: N/A; VOLTAGE: N/A; WATTAGE: N/A
SW1 SW2 = PP_Electromechanical:B3W-9000
SW3 = PP_Electromechanical:5501
U1 = PP_DigitalIC:P8X32A: Manufacturer Part #: P8X32A Manufacturer: Parallax Description: 32-bit Microcontrollers - MCU Propeller Chip
U2-U6 U9 U10 U14 = PP_DigitalIC:STP16CP05
U7 U8 = PP_PowerIC:LINEAR_VOTLAGE_REGULATORS
U11 = PP_DigitalIC:EEPROM_I2C
U12 = PP_Passives:IP4234CZ6: Mouser Part #: 771-IP4234CZ6125 Manufacturer Part #: IP4234CZ6,125 Manufacturer: NXP Semiconductors Description: ESD Suppressors Single USB 2.0 ESD Protection 6-Pin http://www.mouser.com/ProductDetail/NXP-Semiconductors/IP4234CZ6125/?qs=sGAEpiMZZMvxHShE6Whpu7QUdHOfUl1T0xbl582qhFk%3d
U13 = PP_DigitalIC:FT234XD
X1 = MF_Frequency_Control:XTL: Library: MF_Frequency_Control Description: Device for Cyrstal Oscillators. Manufacture part number (MFG#) can be added via Attributes.

## Board
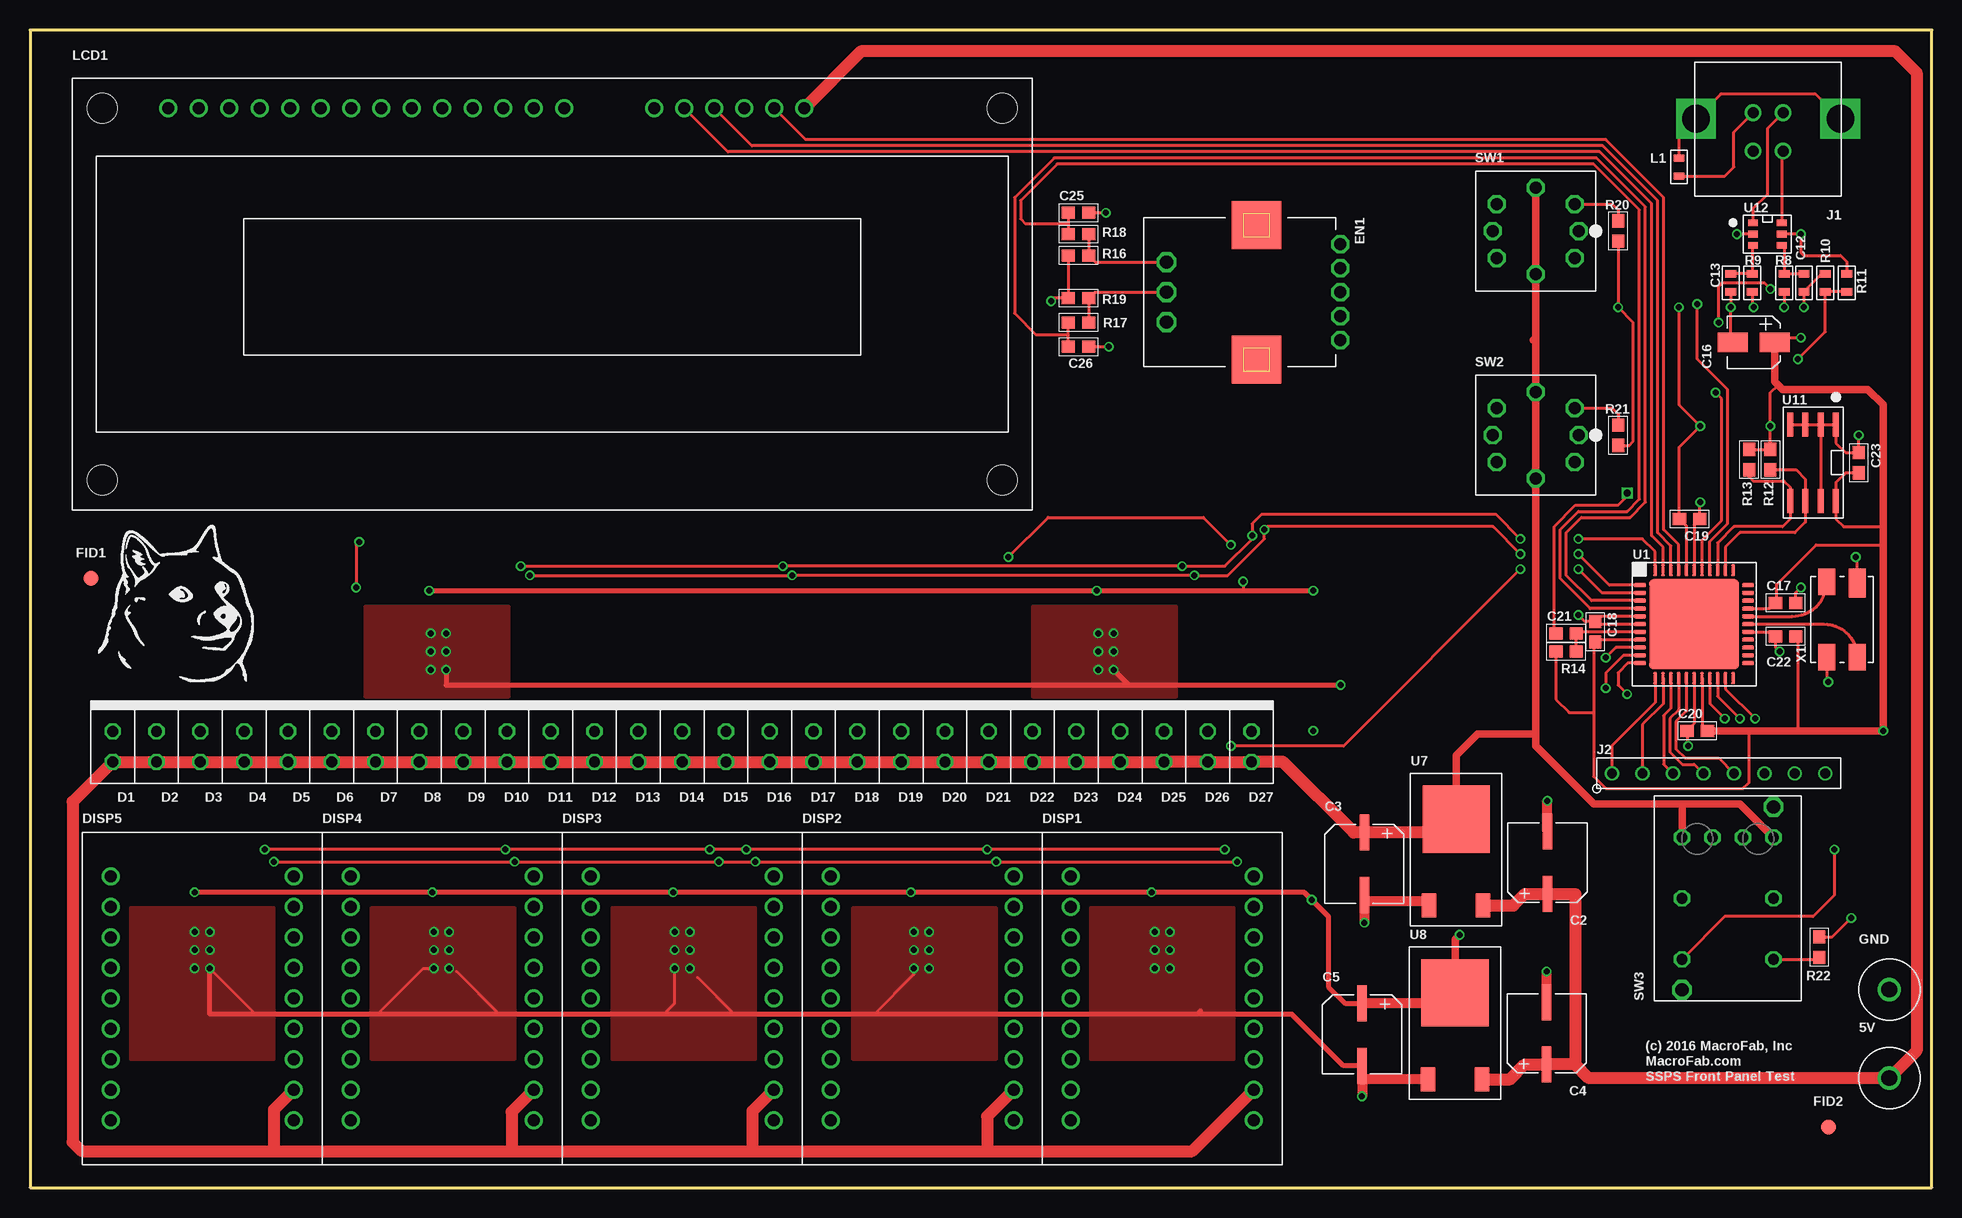
[diagram p3: board, top side]
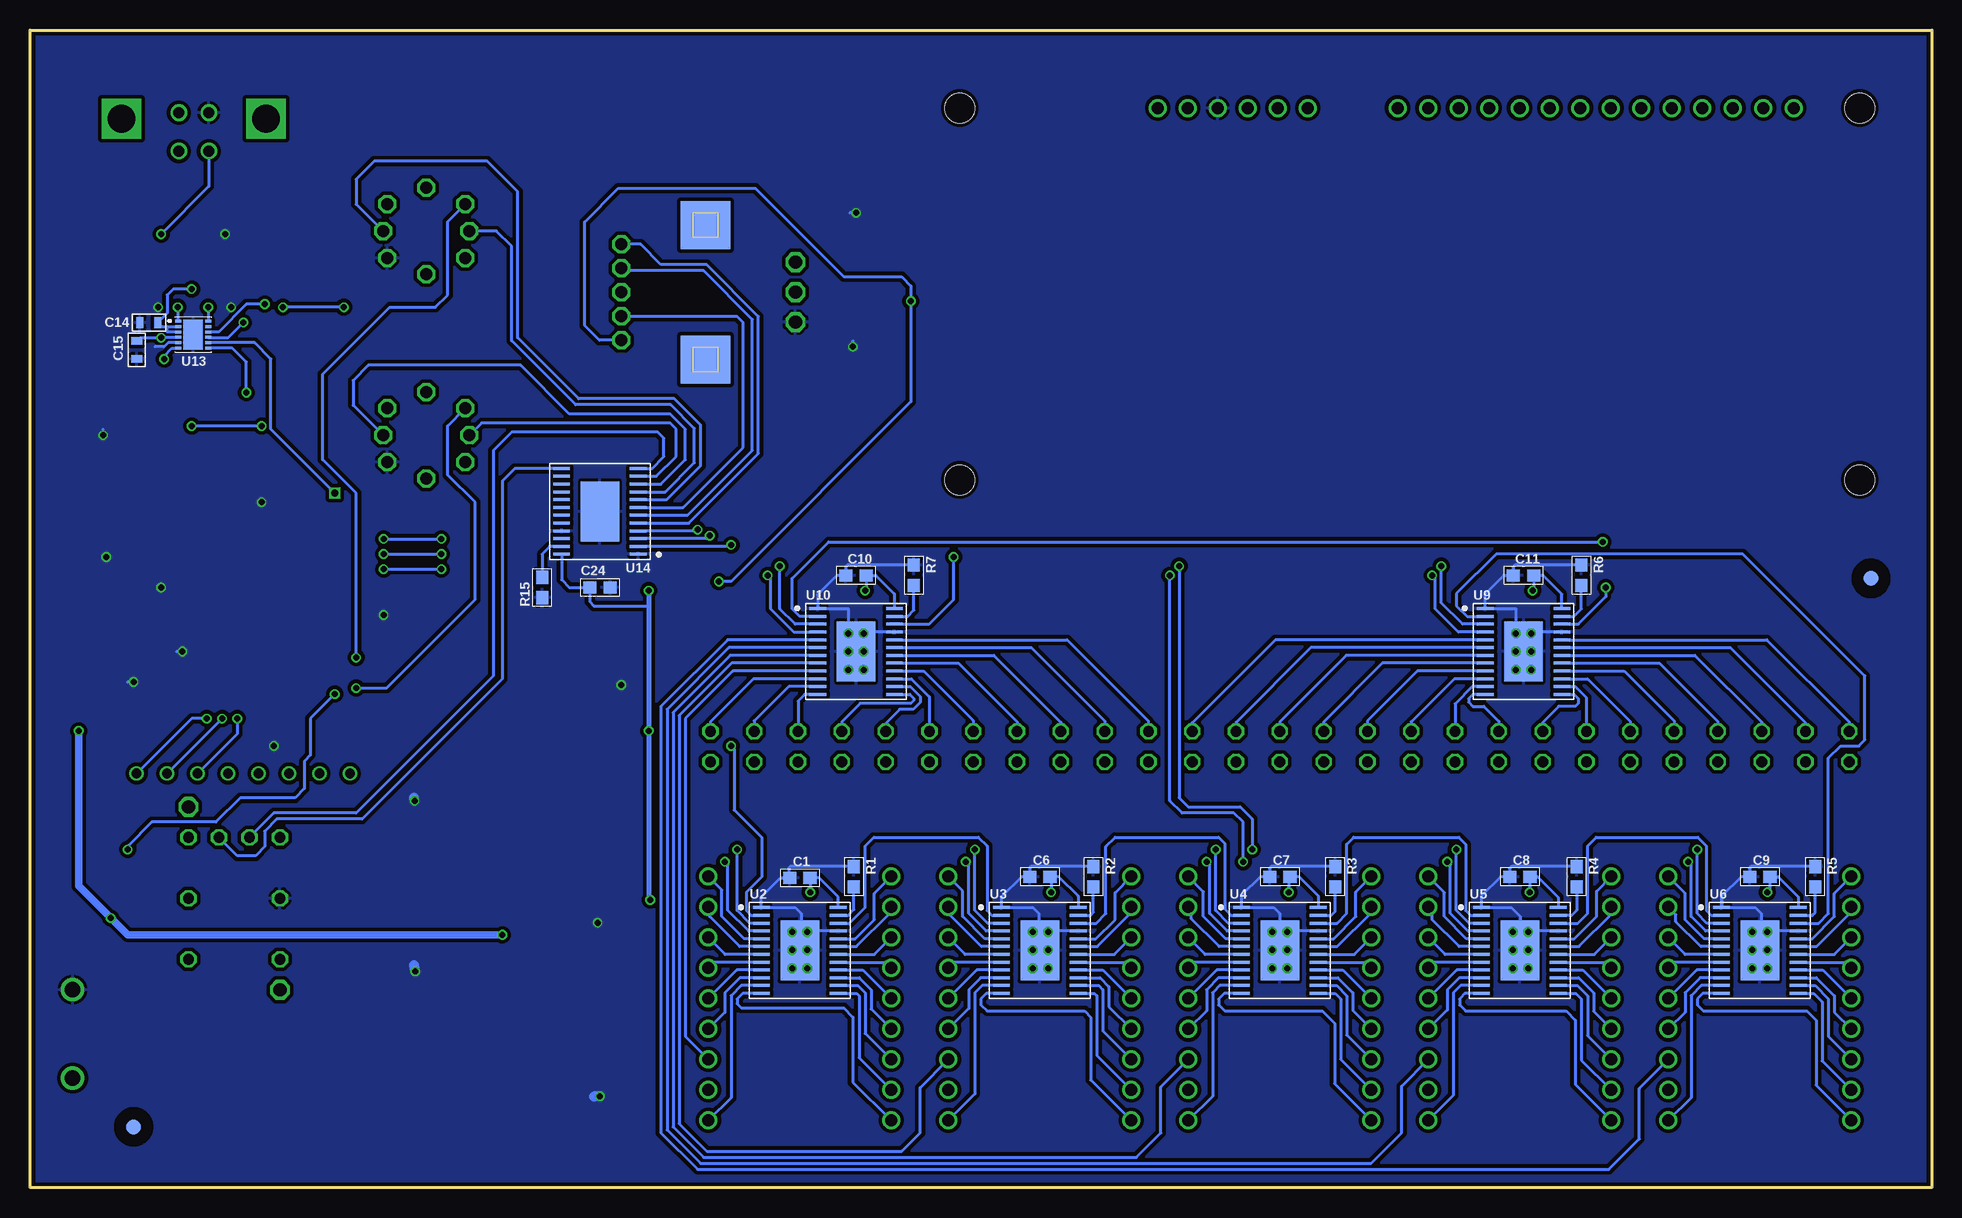
[diagram p4: board, bottom side, seen from below]

Size 158.5 x 96.52 mm. Coordinates in mm from the lower left corner, seen from the top.
Outline: 0,0 158.5,0 158.5,96.52 0,96.52 0,0
Copper layers (1*16): Top 0.035mm / dielectric 1.5mm / Bottom 0.035mm
Design rules "MF_Standard_2_Layer": minimum track width 6mil, minimum drill 12mil, track to track 6mil, track to pad 6mil, pad to pad 6mil, via to via 6mil, smd to smd 0mil, copper to edge 10mil, drill to drill 10mil, minimum pad ring 6mil, minimum via ring 6mil, stop-mask expansion 2mil, vias tented up to drill 25mil, thermal gap 10mil

### Footprints (pad centres in the part's own frame; a part is rotated, then mirrored left to right if it is on the bottom)
KEYSTONE_5115-5119 = drill 1.3: P$1 0,0
0603 = smd 1.1 x 1: 1 -0.85,0; 2 0.85,0
6.3MM_CAP_SMD = smd 0.8 x 3: NEG 0,-2.6; POS 0,2.6
C0603 = smd 0.6 x 0.9: P$1 -0.75,0; P$2 0.75,0
CP4MM = smd 1.6 x 2.5: P$1 0,-1.75; P$2 0,1.75
WP1043 = drill 0.9 octagon: A 0,1.27; C 0,-1.27
PSA08-11SRWA = drill 1: P$1 -7.62,10.16; P$2 -7.62,7.62; P$3 -7.62,5.08; P$4 -7.62,2.54; P$5 -7.62,0; P$6 -7.62,-2.54; P$7 -7.62,-5.08; P$8 -7.62,-7.62; P$9 -7.62,-10.16; P$10 7.62,-10.16; P$11 7.62,-7.62; P$12 7.62,-5.08; P$13 7.62,-2.54; P$14 7.62,0; P$15 7.62,2.54; P$16 7.62,5.08; P$17 7.62,7.62; P$18 7.62,10.16
PEL12T = drill 1 octagon: 1 -4,7; 2 -2,7; 3 0,7; 4 2,7; 5 4,7 | drill 1.1 octagon: A -2.5,-7.5; B 0,-7.5; C 2.5,-7.5 | smd 4 x 4.1 bottom: P$1 5.6,0; P$9 -5.6,0 | smd 4 x 4.1: P$2 5.6,0; P$11 -5.6,0
FIDUCIAL_100MIL = smd 1.27 x 1.27: P$1 0,0 | smd 1.27 x 1.27 bottom: P$2 0,0
61400413321 = drill 0.92: 1 1.25,2.7; 2 -1.25,2.7; 3 -1.25,-0.5; 4 1.25,-0.5 | drill 2.3 square: S1 -6.02,0; S2 6.02,0
2.54MM_01X08_PIN_HEADER = drill 0.8: 1 -8.89,0; 2 -6.35,0; 3 -3.81,0; 4 -1.27,0; 5 1.27,0; 6 3.81,0; 7 6.35,0; 8 8.89,0
L0603 = smd 0.6 x 0.9: P$1 -0.75,0; P$2 0.75,0
CU16025-UW6J = drill 1: P$1 5.5,31; P$2 8.04,31; P$3 10.58,31; P$4 13.12,31; P$5 15.66,31; P$6 18.2,31; P$7 20.74,31; P$8 23.28,31; P$9 25.82,31; P$10 28.36,31; P$11 30.9,31; P$12 33.44,31; P$13 35.98,31; P$14 38.52,31; P$15 46,31; P$16 48.5,31; P$17 51,31; P$18 53.5,31; P$19 56,31; P$20 58.5,31 | hole 2.5: 0,0; 0,31; 75,31; 75,0
R0603 = smd 0.6 x 0.9: P$1 -0.75,0; P$2 0.75,0
B3W-9000 = drill 1 octagon: 1 3.25,-2.25; 2 -3.25,-2.25; 3 3.25,2.25; 4 -3.25,2.25; ANODE_1 0,3.6; ANODE_2 0,-3.6; CATHODE_1 3.6,0; CATHODE_2 -3.6,0
5501 = drill 0.9 octagon: 1A 0,3.81; 1B 0,-3.81; 2 -5.08,-3.81; 3 -5.08,3.81; ANODE_1 5.08,3.81; ANODE_2 5.08,-3.81; CATHODE_1 5.08,1.27; CATHODE_2 5.08,-1.27 | drill 1.1 octagon: MH1 -7.62,3.81; MH2 7.62,-3.81
P8X32A_QFN-44 = smd 1 x 0.33: 1 -4.5,3.25; 2 -4.5,2.6; 3 -4.5,1.95; 4 -4.5,1.3; 5 -4.5,0.65; 6 -4.5,0; 7 -4.5,-0.65; 8 -4.5,-1.3; 9 -4.5,-1.95; 10 -4.5,-2.6; 11 -4.5,-3.25; 23 4.5,-3.25; 24 4.5,-2.6; 25 4.5,-1.95; 26 4.5,-1.3; 27 4.5,-0.65; 28 4.5,0; 29 4.5,0.65; 30 4.5,1.3; 31 4.5,1.95; 32 4.5,2.6; 33 4.5,3.25 | smd 0.33 x 1: 12 -3.25,-4.5; 13 -2.6,-4.5; 14 -1.95,-4.5; 15 -1.3,-4.5; 16 -0.65,-4.5; 17 0,-4.5; 18 0.65,-4.5; 19 1.3,-4.5; 20 1.95,-4.5; 21 2.6,-4.5; 22 3.25,-4.5; 34 3.25,4.5; 35 2.6,4.5; 36 1.95,4.5; 37 1.3,4.5; 38 0.65,4.5; 39 0,4.5; 40 -0.65,4.5; 41 -1.3,4.5; 42 -1.95,4.5; 43 -2.6,4.5; 44 -3.25,4.5 | smd 7.5 x 7.5: PAD 0,0
STP16CP05XTTR_TTSOP-24 = smd 1.4 x 0.25: P$1 -3.2,3.575; P$2 -3.2,2.925; P$3 -3.2,2.275; P$4 -3.2,1.625; P$5 -3.2,0.975; P$6 -3.2,0.325; P$7 -3.2,-0.325; P$8 -3.2,-0.975; P$9 -3.2,-1.625; P$10 -3.2,-2.275; P$11 -3.2,-2.925; P$12 -3.2,-3.575; P$13 3.2,-3.575; P$14 3.2,-2.925; P$15 3.2,-2.275; P$16 3.2,-1.625; P$17 3.2,-0.975; P$18 3.2,-0.325; P$19 3.2,0.325; P$20 3.2,0.975; P$21 3.2,1.625; P$22 3.2,2.275; P$23 3.2,2.925; P$24 3.2,3.575 | smd 3.2 x 5: PAD 0,0
AP1084_TO-252-3L = smd 1.2 x 2: 1 -2.25,-7.2; 2 2.25,-7.2 | smd 5.6 x 5.6: 3 0,0
SOIC-8_W = smd 2 x 0.5: 1 -3.185,1.905; 2 -3.185,0.635; 3 -3.185,-0.635; 4 -3.185,-1.905; 5 3.185,-1.905; 6 3.185,-0.635; 7 3.185,0.635; 8 3.185,1.905
IP4234CZ6_SOT-457-6 = smd 0.8 x 0.55: 1 -1.2,0.95; 2 -1.2,0; 3 -1.2,-0.95; 4 1.2,-0.95; 5 1.2,0; 6 1.2,0.95
FT234X_DFN-12 = smd 0.5 x 0.25: 1 -1.25,1.125; 2 -1.25,0.675; 3 -1.25,0.225; 4 -1.25,-0.225; 5 -1.25,-0.675; 6 -1.25,-1.125; 7 1.25,-1.125; 8 1.25,-0.675; 9 1.25,-0.225; 10 1.25,0.225; 11 1.25,0.675; 12 1.25,1.125 | smd 1.6 x 2.5: P$1 0,0
7MMX5MM = smd 2.2 x 1.4: P$1 -3.15,-1.27; P$2 -3.15,1.27; P$3 3.15,1.27 | smd 2.4 x 1.4: P$4 3.05,-1.27

### Placement (x,y rotation side)
5V  154.94,9.14 0 top
C1  94.35,25.83 180 bottom
C2  126.45,27.1 180 top
C3  111.2,27 0 top
C4  126.39,12.87 180 top
C5  111.01,12.78 0 top
C6  74.35,25.94 180 bottom
C7  54.35,25.94 180 bottom
C8  34.35,25.94 180 bottom
C9  14.35,25.94 180 bottom
C10  89.66,51.05 180 bottom
C11  34.04,51.05 180 bottom
C12  147.83,75.44 270 top
C13  141.73,75.44 270 top
C14  148.59,72.14 180 bottom
C15  149.61,69.85 270 bottom
C16  143.64,70.48 90 top
C17  146.3,48.77 180 top
C18  130.43,46.35 270 top
C19  138.3,55.75 180 top
C20  138.94,38.1 0 top
C21  128.02,46.23 180 top
C22  146.3,45.97 0 top
C23  152.4,60.45 270 top
C24  111,50.04 0 bottom
C25  87.38,81.28 0 top
C26  87.38,70.1 0 top
D1  6.9,36.78 180 top
D2  10.55,36.78 180 top
D3  14.2,36.78 180 top
D4  17.85,36.78 180 top
D5  21.5,36.78 180 top
D6  25.15,36.78 180 top
D7  28.8,36.78 180 top
D8  32.45,36.78 180 top
D9  36.1,36.78 180 top
D10  39.75,36.78 180 top
D11  43.4,36.78 180 top
D12  47.05,36.78 180 top
D13  50.7,36.78 180 top
D14  54.35,36.78 180 top
D15  58,36.78 180 top
D16  61.65,36.78 180 top
D17  65.3,36.78 180 top
D18  68.95,36.78 180 top
D19  72.6,36.78 180 top
D20  76.25,36.78 180 top
D21  79.9,36.78 180 top
D22  83.55,36.78 180 top
D23  87.2,36.78 180 top
D24  90.85,36.78 180 top
D25  94.5,36.78 180 top
D26  98.15,36.78 180 top
D27  101.8,36.78 180 top
DISP1  94.35,15.78 0 top
DISP2  74.35,15.78 0 top
DISP3  54.35,15.78 0 top
DISP4  34.35,15.78 0 top
DISP5  14.35,15.78 0 top
EN1  102.21,74.66 270 top
FID1  5.08,50.8 0 top
FID2  149.86,5.08 0 top
FRAME1  134.62,12.7 0 top
GND  154.94,16.51 0 top
J1  144.85,89.13 180 top
J2  140.72,34.54 0 top
L1  137.41,85.09 270 top
LCD1  6.01,59.01 0 top
R1  89.84,25.92 270 bottom
R2  69.88,25.92 270 bottom
R3  49.75,25.92 270 bottom
R4  29.61,25.92 270 bottom
R5  9.74,25.92 270 bottom
R6  29.21,51.05 270 bottom
R7  84.84,51.05 270 bottom
R8  146.18,75.44 270 top
R9  143.51,75.44 270 top
R10  149.61,75.44 270 top
R11  151.38,75.44 90 top
R12  145.03,60.71 90 top
R13  143.26,60.71 90 top
R14  128.02,44.7 180 top
R15  115.82,50.04 90 bottom
R16  87.38,77.72 180 top
R17  87.38,74.17 180 top
R18  87.38,79.5 180 top
R19  87.38,72.14 0 top
R20  132.33,79.76 90 top
R21  132.33,62.74 90 top
R22  149.1,20.07 270 top
SW1  125.48,79.76 0 top
SW2  125.48,62.74 0 top
SW3  141.48,24.13 90 top
U1  138.68,46.99 0 top
U2  94.35,19.78 0 bottom
U3  74.35,19.78 0 bottom
U4  54.35,19.78 0 bottom
U5  34.35,19.78 0 bottom
U6  14.35,19.78 0 bottom
U7  118.84,30.73 0 top
U8  118.75,16.26 0 top
U9  34.04,44.7 0 bottom
U10  89.66,44.7 0 bottom
U11  148.59,60.45 270 top
U12  144.78,79.5 0 top
U13  144.91,71.12 0 bottom
U14  111,56.39 180 bottom
X1  151,47.37 90 top

### Tracks (layer width: path | path; a pad name or v marks a point on that pad's centre or on a via)
2.5V
  Top 0.61: U7.3 118.84,36.04 120.65,37.85 125.48,37.85 | SW3.ANODE_1 137.67,32 | 125.48,37.85 SW2.ANODE_2 SW2.ANODE_1 125.48,70.87 | 125.48,70.87 SW1.ANODE_2 SW1.ANODE_1 | 125.27,70.66 125.48,70.87 | 137.67,32 130.3,32 125.48,36.83 125.48,37.85 | SW3.ANODE_2 142.49,32 137.67,32
  Top 1.016: U7.3 117.71,29.6 C3.POS 110.3,29.6 104.39,35.51 D27.A D26.A D25.A D24.A D23.A D22.A D21.A D20.A D19.A D18.A D17.A D16.A D15.A D14.A D13.A D12.A D11.A D10.A D9.A D8.A D7.A D6.A D5.A D4.A D3.A D2.A D1.A 3.56,32.17 3.56,3.81 4.32,3.05 20.32,3.05 | 20.32,3.05 40.13,3.05 | 40.13,3.05 60.2,3.05 | 60.2,3.05 79.76,3.05 | 79.76,3.05 96.85,3.05 DISP1.P$11 | DISP2.P$11 79.76,5.95 79.76,3.05 | DISP3.P$11 60.2,6.39 60.2,3.05 | DISP4.P$11 40.13,6.33 40.13,3.05 | DISP5.P$11 20.32,6.51 20.32,3.05
3.3V  (via drill 0.5)
  Top 0.254: C16.P$1 145.77,70.87 v147.57,70.87 | C23.2 151.3,59.6 150.5,58.8 U11.8 150.5,55.75 151.13,55.12 154.43,55.12 | U1.30 144.98,48.29 C17.2 145.54,48.77 145.54,50.29 148.84,53.59 154.18,53.59 154.43,53.34 | U1.8 130.61,45.69 C18.2 130.3,45.38 130.3,39.62 | U1.40 138.03,55.17 C19.2 137.45,61.76 v139.19,63.5 137.41,65.28 v137.41,73.41 | U1.18 139.33,38.55 C20.2 | R14.2 127.17,40.73 128.27,39.62 130.3,39.62 | C22.2 147.32,45.81 147.32,38.1 | R13.2 R12.2 v145.03,63.5 145.03,66.29 145.67,66.93 | R16.2 R17.2 85.34,74.17 v85.09,73.91 | v101.09,50.55 101.09,49.78 | R20.1 v132.33,73.41 133.6,72.14 133.6,62.23 133.26,61.89 R21.1 | R22.1 150.2,20.92 v151.76,22.48 | 130.3,39.62 130.3,34.29 131.32,33.27 142.75,33.27 143.26,33.78 143.26,38.1
  Top 0.406: C5.POS 109.59,15.38 108.2,16.76 108.2,22.61 v106.81,24 106.17,24.64 v93.47,24.64 v73.41,24.64 v53.59,24.64 v33.53,24.64 v13.72,24.64 | v106.93,49.78 101.09,49.78 v88.9,49.78 v33.27,49.78
  Top 0.61: v119.13,21.08 118.75,20.71 U8.3 | C20.2 143.26,38.1 147.32,38.1 v154.43,38.1 154.43,53.34 154.43,55.12 154.43,65.28 153.16,66.55 146.05,66.55 145.67,66.93 145.39,67.21 C16.P$1
  Top 0.813: 118.75,15.38 C5.POS
  Top 1.016: U8.3 118.75,15.38
  Bottom 0.254: U2.P$24 91.15,24.24 92.74,25.83 C1.1 93.47,25.8 v93.47,24.64 | U3.P$24 71.15,24.31 72.77,25.94 C6.1 73.41,25.94 v73.41,24.64 | U4.P$24 51.15,24.34 52.74,25.94 C7.1 53.59,25.94 v53.59,24.64 | U5.P$24 31.15,24.23 32.85,25.94 C8.1 33.53,25.94 v33.53,24.64 | U6.P$24 11.15,24.27 12.81,25.94 C9.1 13.5,24.64 v13.72,24.64 | U9.P$24 30.84,49.49 32.4,51.05 C11.1 33.19,49.62 v33.27,49.78 | U10.P$24 86.46,49.51 88.01,51.05 C10.1 88.81,49.78 v88.9,49.78 | U13.4 147.54,70.89 v147.57,70.87 149.34,70.87 C15.P$1 | U14.P$24 114.2,50.7 113.54,50.04 C24.1 111.85,48.86 111.51,48.51 106.93,48.51 | v139.19,63.5 v145.03,63.5 | v101.09,50.55 100.08,50.55 85.09,65.53 v85.09,73.91 85.09,75.18 85.85,75.95 90.68,75.95 98.04,83.31 109.47,83.31 112.27,80.52 112.27,71.88 111.05,70.66 EN1.5 | v132.33,73.41 v137.41,73.41
  Bottom 0.406: v106.93,49.78 106.93,48.51 v106.93,38.1 106.93,24.13 v106.81,24
  Bottom 0.61: v154.43,38.1 154.43,25.15 v151.76,22.48 150.37,21.08 v119.13,21.08
3V3OUT  (via drill 0.5)
  Top 0.254: v140.72,72.14 140.72,75.18 140.97,75.44 144.53,75.44 v145.03,74.93
  Bottom 0.254: 147.07,71.8 147.5,71.8 C14.P$1 147.07,72.91 147.07,74.42 146.56,74.93 v145.03,74.93 | 147.07,71.8 U13.2 | U13.3 147.07,71.34 147.07,71.8 | U13.9 141.96,70.89 v140.72,72.14
D+_USB
  Top 0.254: J1.3 144.78,88.31 144.78,82.8 143.58,81.6 U12.1
D-_USB
  Top 0.254: J1.2 145.98,86.31 U12.6
DISP1_A
  Bottom 0.254: U2.P$20 89.73,20.75 88.14,22.35 88.14,24.53 DISP1.P$1
DISP1_B
  Bottom 0.254: U2.P$5 98.99,20.75 100.84,22.61 100.84,24.81 DISP1.P$18
DISP1_C
  Bottom 0.254: U2.P$7 100.56,19.45 DISP1.P$16
DISP1_D
  Bottom 0.254: U2.P$10 99.33,17.5 100.58,16.26 100.58,14.62 DISP1.P$13
DISP1_DATA  (via drill 0.5)
  Top 0.254: U1.2 131,49.59 v129.03,51.56 | v100.08,36.83 109.47,36.83 v124.21,51.56
  Bottom 0.254: v129.03,51.56 v124.21,51.56 | v100.08,36.83 99.82,36.58 99.82,31.5 97.54,29.21 97.54,25.91 98.81,24.64 98.81,23.11 98.4,22.7 U2.P$2
DISP1_DP
  Bottom 0.254: U10.P$9 99.92,43.08 103.89,39.12 103.89,12.62 DISP1.P$12
DISP1_E
  Bottom 0.254: U2.P$11 99.22,16.86 100.08,16 100.08,7.51 DISP1.P$10
DISP1_F
  Bottom 0.254: U2.P$12 99.11,16.2 99.57,15.75 99.57,15.35 99.21,14.99 90.68,14.99 89.92,14.22 89.92,8.81 DISP1.P$9
DISP1_G
  Bottom 0.254: U2.P$13 89.61,16.2 89.41,16 89.41,10.84 DISP1.P$8
DISP1_H
  Bottom 0.254: U2.P$17 87.21,18.8 DISP1.P$4
DISP1_K
  Bottom 0.254: U2.P$18 88.13,19.45 DISP1.P$3
DISP1_M
  Bottom 0.254: U2.P$19 89.62,20.11 86.87,22.86 86.87,23.26 DISP1.P$2
DISP1_N
  Bottom 0.254: U2.P$6 99.35,20.11 101.85,22.61 101.85,23.29 DISP1.P$17
DISP1_P
  Bottom 0.254: U2.P$8 101.48,18.8 DISP1.P$15
DISP1_R
  Bottom 0.254: U2.P$9 99.59,18.16 DISP1.P$14
DISP1_S
  Bottom 0.254: U2.P$15 89.39,17.5 88.39,16.51 88.39,14.91 DISP1.P$6
DISP1_T
  Bottom 0.254: U2.P$14 89.5,16.86 88.9,16.26 88.9,12.87 DISP1.P$7
DISP1_U
  Bottom 0.254: U2.P$16 89.1,18.16 DISP1.P$5
DISP2_A
  Bottom 0.254: U3.P$20 69.67,20.75 68.07,22.35 68.07,24.59 DISP2.P$1
DISP2_B
  Bottom 0.254: U3.P$5 78.92,20.75 80.77,22.61 80.77,24.75 DISP2.P$18
DISP2_C
  Bottom 0.254: U3.P$7 80.56,19.45 DISP2.P$16
DISP2_D
  Bottom 0.254: U3.P$10 79.27,17.5 80.26,16.51 80.26,14.94 DISP2.P$13
DISP2_DATA
  Bottom 0.254: U2.P$22 90.21,22.05 88.9,23.37 88.9,28.49 88.18,29.21 79.46,29.21 78.74,28.49 78.74,23.11 78.33,22.7 U3.P$2
DISP2_DP
  Bottom 0.254: U10.P$8 100.03,43.73 104.39,39.37 104.39,5.33 102.11,3.05 85.85,3.05 84.33,4.57 84.33,8.34 DISP2.P$12
DISP2_E
  Bottom 0.254: U3.P$11 79.16,16.86 79.76,16.26 79.76,7.83 DISP2.P$10
DISP2_F
  Bottom 0.254: U3.P$12 78.79,16.2 79.25,15.75 79.25,15.24 78.74,14.73 70.61,14.73 70.1,14.22 70.1,9 DISP2.P$9
DISP2_G
  Bottom 0.254: U3.P$13 69.8,16.2 69.6,16 69.6,11.03 DISP2.P$8
DISP2_H
  Bottom 0.254: U3.P$17 67.21,18.8 DISP2.P$4
DISP2_K
  Bottom 0.254: U3.P$18 68.13,19.45 DISP2.P$3
DISP2_M
  Bottom 0.254: U3.P$19 69.56,20.11 66.8,22.86 66.8,23.32 DISP2.P$2
DISP2_N
  Bottom 0.254: U3.P$6 79.2,20.11 81.79,22.69 81.79,23.22 DISP2.P$17
DISP2_P
  Bottom 0.254: U3.P$8 81.48,18.8 DISP2.P$15
DISP2_R
  Bottom 0.254: U3.P$9 79.59,18.16 DISP2.P$14
DISP2_S
  Bottom 0.254: U3.P$15 69.32,17.5 68.58,16.76 68.58,15.09 DISP2.P$6
DISP2_T
  Bottom 0.254: U3.P$14 69.43,16.86 69.09,16.51 69.09,13.06 DISP2.P$7
DISP2_U
  Bottom 0.254: U3.P$16 69.1,18.16 DISP2.P$5
DISP3_A
  Bottom 0.254: U4.P$20 49.86,20.75 48.01,22.61 48.01,24.66 DISP3.P$1
DISP3_B
  Bottom 0.254: U4.P$5 58.85,20.75 60.71,22.61 60.71,24.68 DISP3.P$18
DISP3_C
  Bottom 0.254: U4.P$7 60.56,19.45 DISP3.P$16
DISP3_D
  Bottom 0.254: U4.P$10 59.46,17.5 60.45,16.51 60.45,14.75 DISP3.P$13
DISP3_DATA
  Bottom 0.254: U3.P$22 69.64,22.05 68.83,22.86 68.83,28.45 68.07,29.21 59.44,29.21 58.93,28.7 58.93,23.24 58.4,22.7 U4.P$2
DISP3_DP
  Bottom 0.254: U10.P$7 100.15,44.38 104.9,39.62 104.9,5.08 102.36,2.54 66.29,2.54 64.26,4.57 64.26,8.4 DISP3.P$12
DISP3_E
  Bottom 0.254: U4.P$11 59.34,16.86 59.94,16.26 59.94,7.64 DISP3.P$10
DISP3_F
  Bottom 0.254: U4.P$12 58.98,16.2 59.44,15.75 59.44,15.24 58.93,14.73 50.8,14.73 49.78,13.72 49.78,8.68 DISP3.P$9
DISP3_G
  Bottom 0.254: U4.P$13 49.73,16.2 49.28,15.75 49.28,10.71 DISP3.P$8
DISP3_H
  Bottom 0.254: U4.P$17 47.21,18.8 DISP3.P$4
DISP3_K
  Bottom 0.254: U4.P$18 48.13,19.45 DISP3.P$3
DISP3_M
  Bottom 0.254: U4.P$19 49.56,20.11 46.74,22.93 DISP3.P$2
DISP3_N
  Bottom 0.254: U4.P$6 59.39,20.11 61.72,22.43 61.72,23.16 DISP3.P$17
DISP3_P
  Bottom 0.254: U4.P$8 61.48,18.8 DISP3.P$15
DISP3_R
  Bottom 0.254: U4.P$9 59.59,18.16 DISP3.P$14
DISP3_S
  Bottom 0.254: U4.P$15 49.51,17.5 48.26,16.26 48.26,14.77 DISP3.P$6
DISP3_T
  Bottom 0.254: U4.P$14 49.62,16.86 48.77,16 48.77,12.74 DISP3.P$7
DISP3_U
  Bottom 0.254: U4.P$16 49.1,18.16 DISP3.P$5
DISP4_A
  Bottom 0.254: U5.P$20 29.79,20.75 27.94,22.61 27.94,24.73 DISP4.P$1
DISP4_B
  Bottom 0.254: U5.P$5 38.79,20.75 40.64,22.61 40.64,24.61 DISP4.P$18
DISP4_C
  Bottom 0.254: U5.P$7 40.56,19.45 DISP4.P$16
DISP4_D
  Bottom 0.254: U5.P$10 39.39,17.5 40.39,16.51 40.39,14.82 DISP4.P$13
DISP4_DATA
  Bottom 0.254: U4.P$22 49.57,22.05 48.77,22.86 48.77,28.64 48.2,29.21 39.43,29.21 38.86,28.64 38.86,23.11 38.45,22.7 U5.P$2
DISP4_DP
  Bottom 0.254: U10.P$6 100.26,45.03 105.41,39.88 105.41,4.83 102.62,2.03 46.74,2.03 44.2,4.57 44.2,8.47 DISP4.P$12
DISP4_E
  Bottom 0.254: U5.P$11 39.28,16.86 39.88,16.26 39.88,7.71 DISP4.P$10
DISP4_F
  Bottom 0.254: U5.P$12 38.91,16.2 39.37,15.75 39.37,15.24 38.86,14.73 30.48,14.73 29.72,13.97 29.72,8.61 DISP4.P$9
DISP4_G
  Bottom 0.254: U5.P$13 29.67,16.2 29.21,15.75 29.21,10.64 DISP4.P$8
DISP4_H
  Bottom 0.254: U5.P$17 27.21,18.8 DISP4.P$4
DISP4_K
  Bottom 0.254: U5.P$18 28.13,19.45 DISP4.P$3
DISP4_M
  Bottom 0.254: U5.P$19 29.43,20.11 26.73,22.8 DISP4.P$2
DISP4_N
  Bottom 0.254: U5.P$6 39.41,20.11 41.66,22.35 41.66,23.09 DISP4.P$17
DISP4_P
  Bottom 0.254: U5.P$8 41.48,18.8 DISP4.P$15
DISP4_R
  Bottom 0.254: U5.P$9 39.59,18.16 DISP4.P$14
DISP4_S
  Bottom 0.254: U5.P$15 29.44,17.5 28.19,16.26 28.19,14.71 DISP4.P$6
DISP4_T
  Bottom 0.254: U5.P$14 29.55,16.86 28.7,16 28.7,12.68 DISP4.P$7
DISP4_U
  Bottom 0.254: U5.P$16 29.1,18.16 DISP4.P$5
DISP5_A
  Bottom 0.254: U6.P$20 9.98,20.75 8.13,22.61 8.13,24.54 DISP5.P$1
DISP5_B
  Bottom 0.254: U6.P$5 18.98,20.75 20.57,22.35 20.57,24.55 DISP5.P$18
DISP5_C
  Bottom 0.254: U6.P$7 20.56,19.45 DISP5.P$16
DISP5_D
  Bottom 0.254: U6.P$10 19.32,17.5 20.57,16.26 20.57,14.63 DISP5.P$13
DISP5_DATA
  Bottom 0.254: U5.P$22 29.51,22.05 28.7,22.86 28.7,28.49 27.98,29.21 19.51,29.21 18.8,28.49 18.8,23.11 18.39,22.7 U6.P$2
DISP5_DP
  Bottom 0.254: U10.P$5 100.37,45.68 105.92,40.13 105.92,4.57 102.87,1.52 26.92,1.52 24.38,4.06 24.38,8.28 DISP5.P$12
DISP5_E
  Bottom 0.254: U6.P$11 19.21,16.86 20.07,16 20.07,7.52 DISP5.P$10
DISP5_F
  Bottom 0.254: U6.P$12 19.1,16.2 19.56,15.75 19.56,15.24 19.05,14.73 10.41,14.73 9.65,13.97 9.65,8.55 DISP5.P$9
DISP5_G
  Bottom 0.254: U6.P$13 9.86,16.2 9.14,15.49 9.14,10.58 DISP5.P$8
DISP5_H
  Bottom 0.254: U6.P$17 7.21,18.8 DISP5.P$4
DISP5_K
  Bottom 0.254: U6.P$18 8.13,19.45 DISP5.P$3
DISP5_M
  Bottom 0.254: U6.P$19 9.61,20.11 6.73,22.99 DISP5.P$2
DISP5_N
  Bottom 0.254: U6.P$6 19.26,20.11 21.34,22.18 21.34,22.77 DISP5.P$17
DISP5_P
  Bottom 0.254: U6.P$8 21.48,18.8 DISP5.P$15
DISP5_R
  Bottom 0.254: U6.P$9 19.59,18.16 DISP5.P$14
DISP5_S
  Bottom 0.254: U6.P$15 9.63,17.5 8.13,16 8.13,14.64 DISP5.P$6
DISP5_T
  Bottom 0.254: U6.P$14 9.74,16.86 8.64,15.75 8.64,12.61 DISP5.P$7
DISP5_U
  Bottom 0.254: U6.P$16 9.1,18.16 DISP5.P$5
DISP6_DATA
  Bottom 0.254: U6.P$22 9.44,22.05 8.64,22.86 8.64,35.81 7.62,36.83 6.1,36.83 5.59,37.34 5.59,42.67 15.75,52.83 36.32,52.83 39.62,49.53 39.62,48.51 38.74,47.63 U9.P$2
DISP7_DATA  (via drill 0.5)
  Top 0.254: v27.43,53.85 27.18,53.59 v27.18,50.04
  Bottom 0.254: U9.P$22 29.48,46.98 27.18,49.28 v27.18,50.04 | U10.P$2 94.36,47.63 95,48.26 95,50.8 91.95,53.85 v27.43,53.85
DISP8_DATA  (via drill 0.5)
  Top 0.254: v81.53,52.58 84.84,55.88 97.79,55.88 v100.08,53.59
  Bottom 0.254: U10.P$22 83.58,46.98 81.53,49.02 v81.53,52.58 | v100.08,53.59 100.21,53.46 U14.P$2
DISPX_CLK  (via drill 0.5)
  Top 0.254: v99.57,28.19 v79.76,28.19 v59.69,28.19 v56.64,28.19 v39.62,28.19 v19.56,28.19 | v40.89,51.82 v62.74,51.82 v96.01,51.82 99.57,51.82 101.85,54.1 v101.85,54.36 101.85,55.37 102.62,56.13 122.17,56.13 v124.21,54.1 | U1.44 135.43,53.03 134.37,54.1 v129.03,54.1
  Bottom 0.254: U2.P$3 98.51,22.05 99.57,23.11 v99.57,28.19 | U6.P$3 18.75,22.05 19.56,22.86 v19.56,28.19 | U3.P$3 78.7,22.05 79.76,23.11 v79.76,28.19 | U4.P$3 58.63,22.05 59.69,23.11 v59.69,28.19 | U5.P$3 38.56,22.05 39.62,23.11 v39.62,28.19 | v62.74,51.82 62.74,32.51 61.98,31.75 57.66,31.75 56.64,30.73 v56.64,28.19 | U9.P$3 39.1,46.98 40.89,48.77 v40.89,51.82 | U10.P$3 94.73,46.98 96.01,48.26 v96.01,51.82 | 107.79,54.1 U14.P$3 102.1,54.11 v101.85,54.36 | v129.03,54.1 v124.21,54.1
DISPX_LAT  (via drill 0.5)
  Top 0.254: v20.32,27.18 v40.39,27.18 v57.4,27.18 v60.45,27.18 v80.52,27.18 v100.58,27.18 | v41.66,51.05 v63.5,51.05 v97.03,51.05 99.82,51.05 102.87,54.1 v102.87,54.86 103.12,55.12 121.92,55.12 v124.21,52.83 | U1.1 131.62,50.24 v129.03,52.83
  Bottom 0.254: U2.P$4 98.62,21.41 100.33,23.11 100.33,26.92 v100.58,27.18 | U6.P$4 18.86,21.41 20.07,22.61 20.07,26.92 v20.32,27.18 | U3.P$4 78.81,21.41 80.26,22.86 80.26,26.92 v80.52,27.18 | U4.P$4 58.74,21.41 60.2,22.86 60.2,26.92 v60.45,27.18 | U5.P$4 38.68,21.41 40.13,22.86 40.13,26.92 v40.39,27.18 | U10.P$4 94.84,46.33 96.77,48.26 96.77,50.8 v97.03,51.05 | v57.4,27.18 57.4,30.48 58.17,31.24 62.48,31.24 63.5,32.26 v63.5,51.05 | U9.P$4 39.47,46.33 41.4,48.26 41.4,50.8 v41.66,51.05 | v102.87,54.86 102.97,54.76 U14.P$4 | v129.03,52.83 v124.21,52.83
ENCODER_A
  Top 0.254: C25.1 86.53,80.39 | 86.53,80.39 R18.2 | U1.4 130.02,48.29 127.51,50.8 127.51,54.86 129.03,56.39 133.1,56.39 134.11,57.4 134.11,81.53 130.3,85.34 85.6,85.34 82.55,82.3 82.55,80.77 82.93,80.39 86.53,80.39
ENCODER_B
  Top 0.254: C26.1 86.53,71.12 | 86.53,71.12 R19.1 | U1.3 130.13,48.94 128.02,51.05 128.02,54.61 129.29,55.88 133.35,55.88 134.62,57.15 134.62,81.79 130.56,85.85 85.34,85.85 82.04,82.55 82.04,72.9 83.82,71.12 86.53,71.12
GND  (via drill 0.5)
  Top 0.254: v14.99,18.29 18.8,14.48 28.96,14.48 32.77,18.29 v33.66,18.29 | 35.56,18.03 39.12,14.48 41.15,14.48 | 52.83,14.48 53.72,15.37 v53.72,18.29 | 55.63,17.53 58.67,14.48 70.36,14.48 73.66,17.78 v73.66,18.29 | v147.83,73.41 C12.P$2 149.33,76.19 R10.P$1 | C13.P$2 v141.73,73.41 141.73,70.64 C16.P$2 | U12.2 v142.24,79.5 | L1.P$2 141.24,84.34 141.99,85.09 141.99,88.02 J1.4 | X1.P$4 152.27,52.45 v152.15,52.58 | X1.P$2 149.73,42.29 v149.86,42.16 | v152.4,62.74 C23.1 151.3,61.3 150.5,62.1 U11.1 U11.2 | U11.4 U11.3 U11.2 | U11.2 U11.7 | U1.27 145.09,46.34 C22.1 145.45,45.05 v145.8,44.7 | C17.1 147.15,49.62 v147.57,50.04 | C18.1 130.64,46.99 U1.6 | U1.39 138.68,55.28 C19.1 139.15,57.11 v139.19,57.15 | U1.17 138.68,38.7 C20.1 138.09,36.92 v138.18,36.83 | U1.5 130.86,47.64 C18.1 | C18.1 129.58,47.2 v129.03,47.75 | C26.2 v89.92,70.1 | C25.2 v89.66,81.28
  Top 0.406: C5.NEG 109.45,10.18 105.16,14.48 97.54,14.48 97.54,14.73 97.28,14.48 70.36,14.48 52.83,14.48 41.15,14.48 28.96,14.48 14.99,14.48 v14.99,18.29 | v90.3,43.18 91.57,41.91 | 91.57,41.91 v109.22,41.91 | v34.67,43.18 34.67,41.91 91.57,41.91
  Top 0.813: C3.NEG 111.2,23.88 | 111.2,23.88 v111.2,22.1 | 111.01,9.06 v111.01,7.62 v111,7.62 | U7.1 116.59,23.88 111.2,23.88 | 116.5,9.14 U8.1 111.01,9.06 | C2.NEG v126.45,32.26 | C4.NEG v126.39,18.03 | 111.01,9.06 C5.NEG
  Bottom 0.254: U2.P$21 93.98,21.41 94.23,21.41 | 94.23,21.41 94.35,21.41 U2.PAD | U3.P$21 74.35,21.41 | 74.35,21.41 U3.PAD | U4.P$21 54.35,21.41 | 54.35,21.41 U4.PAD | U5.P$21 34.35,21.41 | 34.35,21.41 U5.PAD | U6.P$21 14.22,21.41 | 14.22,21.41 14.73,21.41 14.73,19.3 14.35,19.3 U6.PAD | R1.1 95.15,26.77 95.25,26.67 95.25,25.88 C1.2 95.97,25.83 97.55,24.26 U2.P$1 94.73,23.36 94.23,22.86 94.23,21.41 | R2.1 75.09,26.77 75.2,26.67 C6.2 75.85,25.94 77.55,24.24 U3.P$1 74.92,23.36 74.42,22.86 74.42,21.48 74.35,21.41 | U4.P$1 54.85,23.36 | R3.1 55.07,26.77 55.2,26.64 C7.2 55.96,25.94 57.55,24.35 U4.P$1 | U5.P$1 35.04,23.36 | R4.1 35.02,26.77 35.2,26.6 C8.2 35.94,25.94 37.55,24.33 U5.P$1 | R5.1 15.09,26.77 15.2,26.66 C9.2 15.89,25.94 17.55,24.28 | R6.1 34.76,51.9 34.89,51.78 C11.2 35.69,51.05 37.24,49.51 U9.P$1 34.67,48.28 v34.67,46.23 | R7.1 90.39,51.9 90.51,51.78 C10.2 91.25,51.05 92.86,49.44 U10.P$1 90.3,48.28 v90.3,46.23 | U10.P$21 89.66,46.33 U10.PAD v89.03,44.7 | U9.P$21 34.04,46.33 U9.PAD v33.4,44.7 | 54.85,23.36 54.36,22.86 54.36,21.41 | 54.36,21.41 54.35,21.41 | 35.04,23.36 34.29,22.61 34.29,21.46 | 34.29,21.46 34.35,21.41 | 14.72,23.36 U6.P$1 17.55,24.28 | 14.72,23.36 14.22,22.86 14.22,21.59 | 14.22,21.59 14.22,21.41 | U3.P$21 74.28,21.41 74.28,19.78 | 71.08,21.41 U3.P$21 | 17.55,24.28 17.53,24.26 17.53,23.37 14.73,23.37 14.72,23.36 | 14.22,21.59 14.99,20.83 v14.99,18.29 | U5.P$1 35.05,23.37 35.04,23.36 | 34.29,21.46 34.29,20.83 35.56,19.56 35.56,18.03 | U4.P$1 54.86,23.37 54.85,23.36 | 54.36,21.41 54.36,21.34 55.12,21.34 55.63,20.83 55.63,17.53 | v147.83,73.41 147.57,73.41 | v141.73,73.41 141.99,73.41
  Bottom 0.254: v142.24,79.5 141.99,79.5 | U13.5 146.98,70.44 147.32,70.1 148.08,70.1 | v152.15,52.58 151.89,52.58 | v149.86,42.16 150.37,42.16 | v152.4,62.74 152.4,63.25 | v147.57,50.04 147.57,50.29 | v145.8,44.7 146.3,44.7 | v89.92,70.1 89.92,70.61 | v89.66,81.28 90.17,81.28
  Bottom 0.406: U5.PAD 34.92,19.78 v34.92,19.81 | 14.73,21.41 14.99,21.41 v14.99,21.34 | v53.72,19.81 54.35,19.81 U4.PAD | v74.93,21.34 74.42,21.34 74.42,21.48 | v93.73,21.34 93.98,21.34 93.98,21.41
  Bottom 0.813: v111,7.62 111.51,7.62 | v126.45,32.26 126.49,32.51 | v126.39,18.03 126.49,18.54
  other vias: 95,21.34 95,19.81 95,18.29 93.73,19.81 93.73,18.29 73.66,21.34 74.93,19.81 74.93,18.29 73.66,19.81 53.72,21.34 54.99,21.34 54.99,19.81 54.99,18.29 33.66,21.34 34.92,21.34 34.92,18.29 33.66,19.81 13.72,21.34 14.99,19.81 13.72,19.81 13.72,18.29 89.03,46.23 90.3,44.7 89.03,43.18 33.4,46.23 34.67,44.7 33.4,43.18
  pour Bottom (isolate 0.305): 0,96.52 158.5,96.52 158.5,0 0,0
  pour Top: 88.39,23.37 100.33,23.37 100.33,10.67 88.39,10.67
  pour Top: 68.58,23.37 80.52,23.37 80.52,10.67 68.58,10.67
  pour Top: 48.51,23.37 60.45,23.37 60.45,10.67 48.51,10.67
  pour Top: 28.45,23.37 40.39,23.37 40.39,10.67 28.45,10.67
  pour Top: 8.38,23.37 20.32,23.37 20.32,10.67 8.38,10.67
  pour Top: 83.57,48.51 95.5,48.51 95.5,40.89 83.57,40.89
  pour Top: 27.94,48.51 39.88,48.51 39.88,40.89 27.94,40.89
LCD_SCK
  Top 0.254: U1.43 136.08,53.4 135.13,54.36 135.13,82.04 130.81,86.36 58.16,86.36 LCD1.P$16
LCD_SI/SO
  Top 0.254: U1.41 137.38,53.62 136.14,54.86 136.14,82.55 131.32,87.38 64.64,87.38 LCD1.P$19
LCD_STB
  Top 0.254: U1.42 136.73,53.51 135.64,54.61 135.64,82.3 131.06,86.87 60.15,86.87 LCD1.P$17
N$1
  Bottom 0.254: U2.P$23 90.33,22.7 89.84,23.19 R1.2
N$2
  Bottom 0.254: U3.P$23 70.15,22.7 69.88,22.98 R2.2
N$3
  Bottom 0.254: U4.P$23 50.08,22.7 49.75,23.04 R3.2
N$4
  Bottom 0.254: R4.2 29.61,23.13 30.04,22.7 U5.P$23
N$5
  Bottom 0.254: U6.P$23 9.97,22.7 9.74,22.93 R5.2
N$6
  Bottom 0.254: U9.P$23 29.84,47.63 29.21,48.26 R6.2
N$7
  Bottom 0.254: U9.P$5 54.72,45.68 61.65,38.76 D16.C
N$8
  Bottom 0.254: U9.P$6 51.77,45.03 58,38.8 D15.C
N$9
  Bottom 0.254: U9.P$7 48.81,44.38 54.35,38.85 D14.C
N$10
  Bottom 0.254: U9.P$8 45.79,43.73 50.7,38.82 D13.C
N$11
  Bottom 0.254: U9.P$9 42.87,43.08 47.05,38.91 D12.C
N$12
  Bottom 0.254: U10.P$20 72.08,45.68 65.3,38.9 D17.C
N$13
  Bottom 0.254: U9.P$11 38.3,41.78 39.75,40.34 D10.C
N$14
  Bottom 0.254: U9.P$12 38.26,41.13 38.61,40.78 38.61,40.49 38.25,40.13 37.34,40.13 36.1,38.88 D9.C
N$15
  Bottom 0.254: U9.P$13 29.81,41.13 29.46,40.78 29.46,40.39 29.72,40.13 31.1,40.13 32.45,38.79 D8.C
N$16
  Bottom 0.254: U9.P$14 29.71,41.78 28.8,40.86 D7.C
N$17
  Bottom 0.254: U9.P$15 28.68,42.43 25.15,38.89 D6.C
N$18
  Bottom 0.254: U9.P$16 25.65,43.08 21.5,38.92 D5.C
N$19
  Bottom 0.254: U9.P$17 22.72,43.73 17.85,38.86 D4.C
N$20
  Bottom 0.254: U9.P$18 19.75,44.38 14.2,38.82 D3.C
N$21
  Bottom 0.254: U9.P$19 16.79,45.03 10.55,38.79 D2.C
N$22
  Bottom 0.254: U9.P$20 13.75,45.68 6.9,38.83 D1.C
N$23
  Bottom 0.254: U10.P$23 85.36,47.63 84.84,48.15 R7.2
N$24
  Bottom 0.254: U10.P$19 75.04,45.03 68.95,38.93 D18.C
N$25
  Bottom 0.254: U10.P$18 78.18,44.38 72.6,38.79 D19.C
N$26
  Bottom 0.254: U10.P$17 81.13,43.73 76.25,38.85 D20.C
N$27
  Bottom 0.254: U10.P$16 84.04,43.08 79.9,38.94 D21.C
N$28
  Bottom 0.254: U10.P$15 85.05,42.43 83.55,40.93 D22.C
N$29
  Bottom 0.254: U10.P$14 85.14,41.78 84.33,40.97 84.33,40.45 84.9,39.88 86.03,39.88 87.2,38.71 D23.C
N$30
  Bottom 0.254: U10.P$13 85.18,41.13 84.84,40.78 84.84,40.64 85.09,40.39 89.31,40.39 90.85,38.85 D24.C
N$31
  Bottom 0.254: U10.P$12 93.94,41.13 94.5,40.57 D25.C
N$32
  Bottom 0.254: U10.P$11 95.29,41.78 98.15,38.92 D26.C
N$33
  Bottom 0.254: U10.P$10 98.21,42.43 101.8,38.85 D27.C
N$34  (via drill 0.5)
  Top 0.254: R8.P$2 v146.18,73.41
  Bottom 0.254: U13.1 146.16,73.41 v146.18,73.41
N$35
  Bottom 0.254: U9.P$10 39.8,42.43 43.4,38.83 D11.C
N$36  (via drill 0.5)
  Top 0.254: R9.P$2 143.51,73.53 v143.64,73.41
  Bottom 0.254: v143.64,73.41 143.66,73.39 U13.12
N$37
  Top 0.254: U12.4 146.18,78.36 R8.P$1 C12.P$1
N$38
  Top 0.254: U12.3 143.51,78.48 R9.P$1 C13.P$1
N$39
  Bottom 0.254: U14.P$23 115.19,53.46 115.82,52.83 R15.2
N$40
  Bottom 0.254: U14.P$5 103.59,55.41 97.79,61.21 97.79,72.64 102.11,76.96 105.92,76.96 107.62,78.66 EN1.1
N$41
  Bottom 0.254: U14.P$6 103.7,56.06 98.3,61.47 98.3,72.39 102.36,76.45 109,76.45 EN1.2
N$42
  Bottom 0.254: U14.P$7 104.07,56.71 99.06,61.72 99.06,72.14 99.57,72.64 109.19,72.64 EN1.4
N$43
  Bottom 0.254: U14.P$8 105.45,57.36 102.62,60.2 102.62,63.6 104.8,65.79 112.78,65.79 117.86,70.87 117.86,83.06 120.4,85.6 129.79,85.6 131.32,84.07 131.32,82 SW1.CATHODE_1
N$44
  Bottom 0.254: U14.P$9 105.56,58.01 103.12,60.45 103.12,63.29 105.11,65.28 113.03,65.28 118.36,70.61 118.36,78.49 119.63,79.76 SW1.CATHODE_2
N$45
  Bottom 0.254: U14.P$10 105.93,58.66 103.89,60.71 103.89,63.25 105.16,64.52 113.54,64.52 117.6,68.58 130.3,68.58 131.57,67.31 131.57,65.23 SW2.CATHODE_1
N$46
  Bottom 0.254: U14.P$11 106.3,59.31 104.65,60.96 104.65,63.25 105.16,63.75 120.86,63.75 SW2.CATHODE_2
N$47
  Bottom 0.254: U14.P$12 106.66,59.96 105.66,60.96 105.66,62.48 106.17,62.99 118.36,62.99 119.89,61.47 119.89,42.67 131.32,31.24 138.18,31.24 SW3.CATHODE_1
N$48
  Bottom 0.254: U14.P$13 118.09,59.96 119.13,58.93 119.13,42.42 130.81,30.73 137.92,30.73 138.94,29.72 138.94,28.45 139.7,27.69 141.22,27.69 SW3.CATHODE_2
N$49
  Top 0.254: SW1.3 131.86,82.01 132.33,81.53 R20.2
N$50
  Top 0.254: SW2.3 131.86,64.99 132.33,64.52 R21.2
N$54
  Top 0.254: SW3.2 149.1,19.05 R22.2
P11
  Top 0.254: U1.12 135.43,40.44 131.83,36.83 J2.1
P12
  Top 0.254: U1.13 136.08,40.33 134.37,38.61 J2.2
P13
  Top 0.254: U1.14 136.73,39.96 136.14,39.37 136.14,35.31 J2.3
P14
  Top 0.254: U1.15 137.38,39.85 136.65,39.12 136.65,36.32 137.67,35.31 138.68,35.31 J2.4
P15
  Top 0.254: U1.16 138.03,39.74 137.16,38.86 137.16,36.58 137.92,35.81 140.72,35.81 J2.5
P16  (via drill 0.5)
  Top 0.254: U1.19 139.98,40.36 v141.22,39.12
  Bottom 0.254: v141.22,39.12 141.22,37.85 J2.6
P17  (via drill 0.5)
  Top 0.254: U1.20 140.63,40.98 v142.49,39.12
  Bottom 0.254: v142.49,39.12 J2.7
P18  (via drill 0.5)
  Top 0.254: U1.21 141.28,41.6 v143.76,39.12
  Bottom 0.254: v143.76,39.12 145.03,39.12 J2.8
RES
  Top 0.254: U1.7 129.23,46.34 C21.1 R14.1
RX  (via drill 0.5)
  Top 0.254: U1.37 139.98,53.88 141.48,55.37 141.48,66.55 138.94,69.09 v138.94,73.66
  Bottom 0.254: v138.94,73.66 140.46,73.66 142.78,71.34 U13.10
SCL
  Top 0.254: R12.1 147.18,59.86 147.96,59.08 U11.6 147.96,55.5 147.07,54.61 142.49,54.61 141.28,53.4 U1.35
SDA
  Top 0.254: R13.1 143.26,59.29 143.62,58.93 146.16,58.93 146.69,58.4 U11.5 146.69,55.75 146.05,55.12 141.99,55.12 140.63,53.77 U1.36
SHIELD
  Top 0.254: L1.P$1 137.41,87.71 J1.S2 140.89,91.19 148.81,91.19 J1.S1
SW_1  (via drill 0.5)
  Top 0.254: U1.9 132.16,45.04 v131.32,44.2
  Bottom 0.254: v131.32,44.2 131.32,57.91 134.11,60.71 134.11,67.82 128.52,73.41 124.71,73.41 123.7,74.42 123.7,80.53 SW1.4
SW_2  (via drill 0.5)
  Top 0.254: U1.10 132.78,44.39 131.32,42.93 v131.32,41.66
  Bottom 0.254: v131.32,41.66 128.78,41.66 121.41,49.02 121.41,57.15 123.7,59.44 123.7,63.52 SW2.4
SW_3  (via drill 0.5)
  Top 0.254: U1.11 133.15,43.74 132.33,42.93 132.33,41.91 v133.1,41.15 | SW3.3 141.22,22.61 148.59,22.61 150.37,24.38 v150.37,28.19
  Bottom 0.254: v133.1,41.15 135.13,39.12 135.13,36.07 135.64,35.56 135.64,33.27 136.4,32.51 140.97,32.51 143,30.48 148.34,30.48 150.37,28.45 v150.37,28.19
TERMINAL_A
  Top 0.254: R18.1 R16.1 88.79,77.16 EN1.A
TERMINAL_B
  Top 0.254: EN1.B 88.72,74.66 R17.1 R19.2
TX  (via drill 0.5)
  Top 0.254: U1.38 139.33,53.99 140.97,55.63 140.97,65.79 v140.46,66.29
  Bottom 0.254: v140.46,66.29 140.46,68.83 141.62,70 U13.7
USB_!RST  (via drill 0.6)
  Top 0.254: C21.2 127,46.23 127,55.12 128.78,56.9 132.33,56.9 133.1,57.66 v133.1,57.91
  Bottom 0.254: v133.1,57.91 138.43,63.25 138.43,69.09 139.79,70.44 U13.8
V_USB_0  (via drill 0.5)
  Top 0.254: U12.5 v147.57,79.5 147.57,77.98 147.83,77.72 150.88,77.72 151.38,77.22 R11.P$2
  Bottom 0.254: J1.1 143.6,83.48 v147.57,79.5
VBUS_SENSE  (via drill 0.5)
  Top 0.254: 151.4,74.68 R11.P$1 R10.P$2 149.61,71.37 v147.32,69.09
  Bottom 0.254: v147.32,69.09 147.32,69.35 146.67,70 U13.6
VIN
  Top 1.016: U7.2 123.61,23.53 124.57,24.5 C2.POS 128.78,24.5 128.78,10.27 | U8.2 123.36,9.06 124.57,10.27 C4.POS 128.78,10.27 | 128.78,10.27 129.91,9.14 5V.P$1 157.23,11.43 157.23,92.96 155.45,94.74 69.24,94.74 LCD1.P$20
X0
  Top 0.254: U1.29 146.85,47.64 arc90 X1.P$3
X1
  Top 0.254: U1.28 149.5,46.99 arc-90 X1.P$1